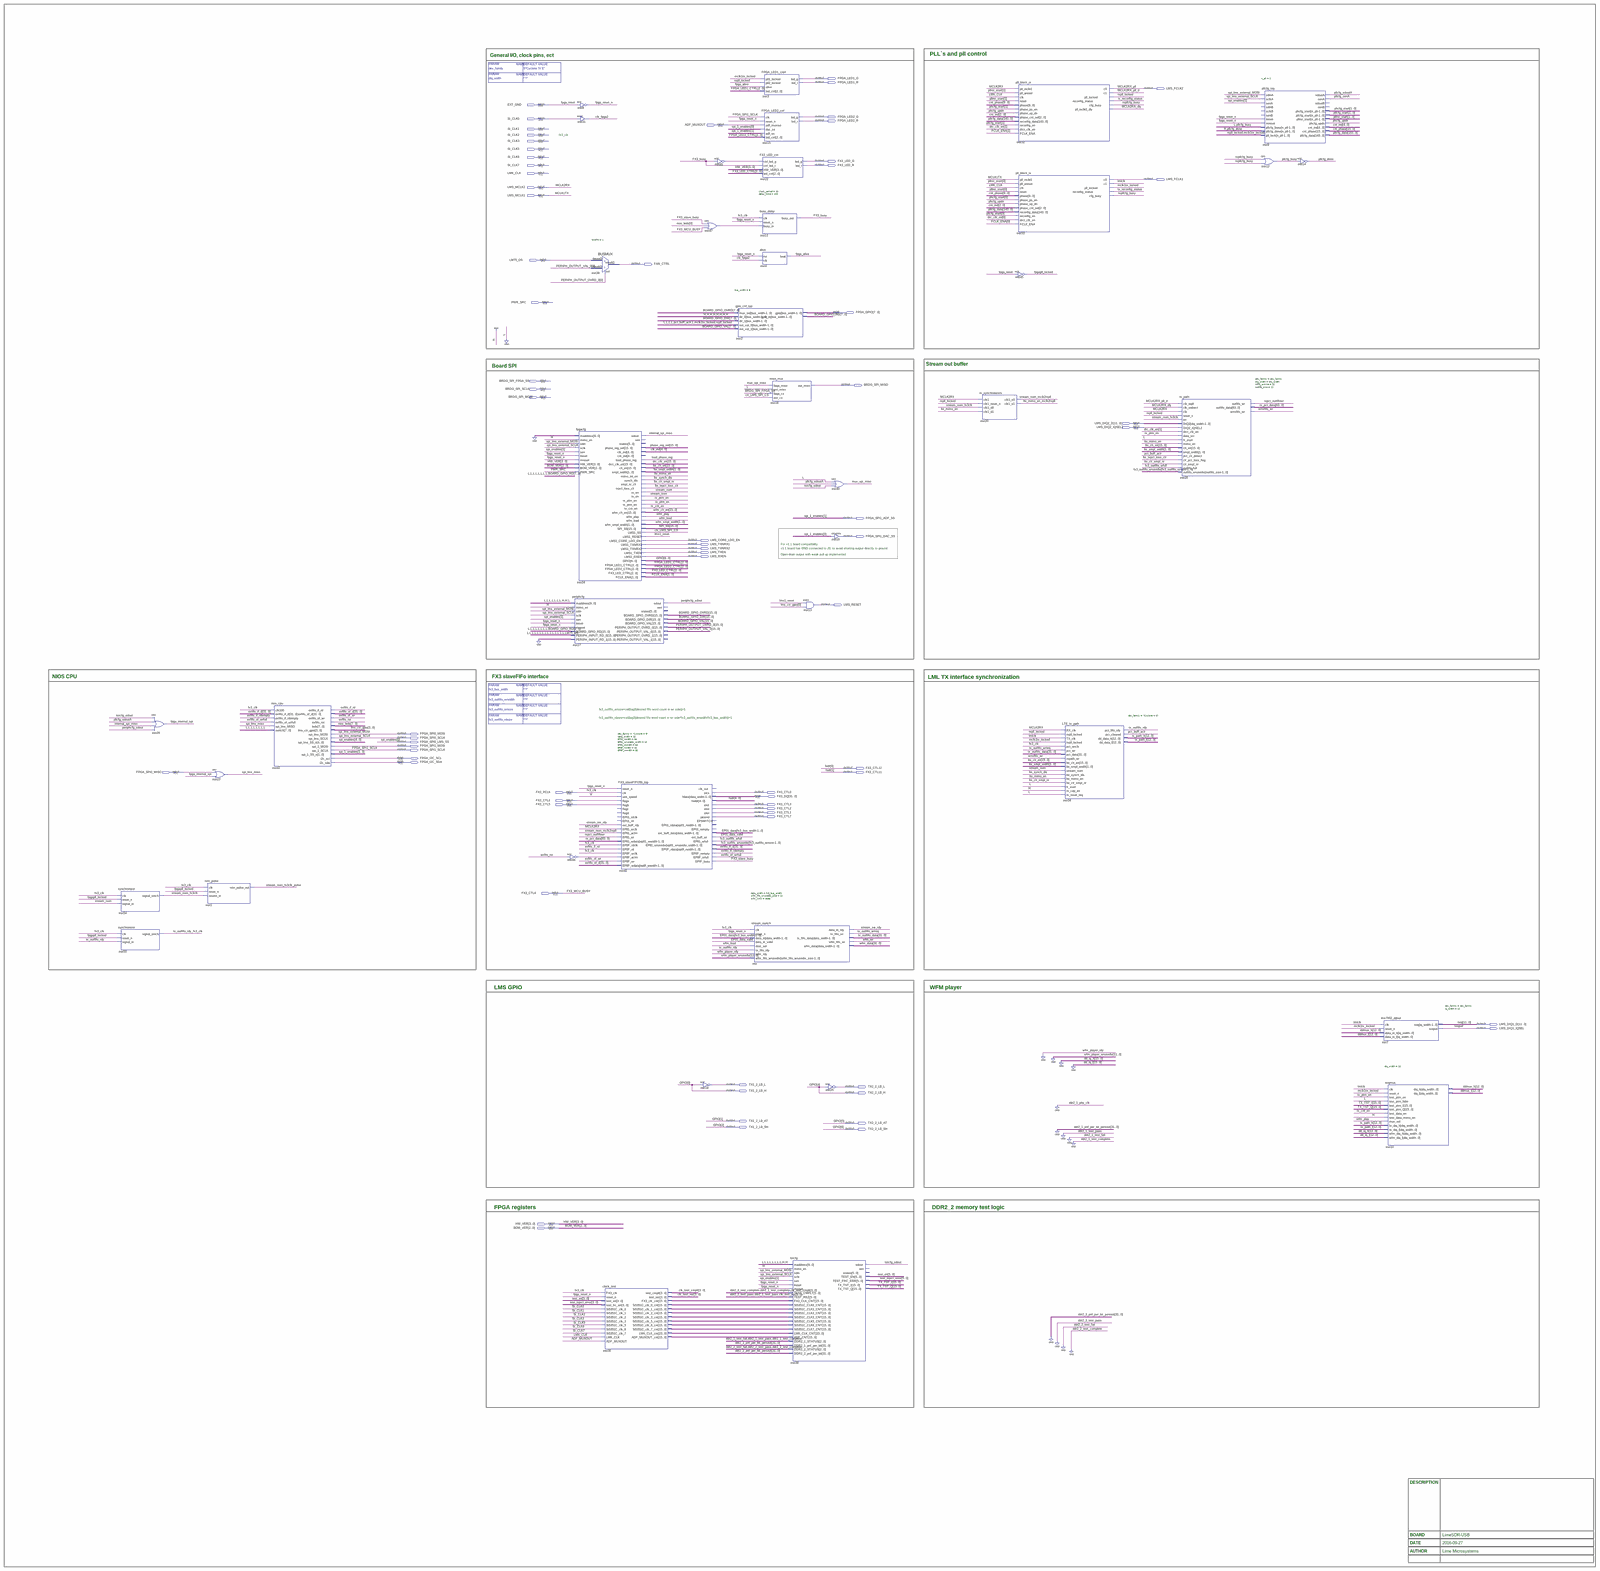
[diagram p0: schematic sheet, whole]
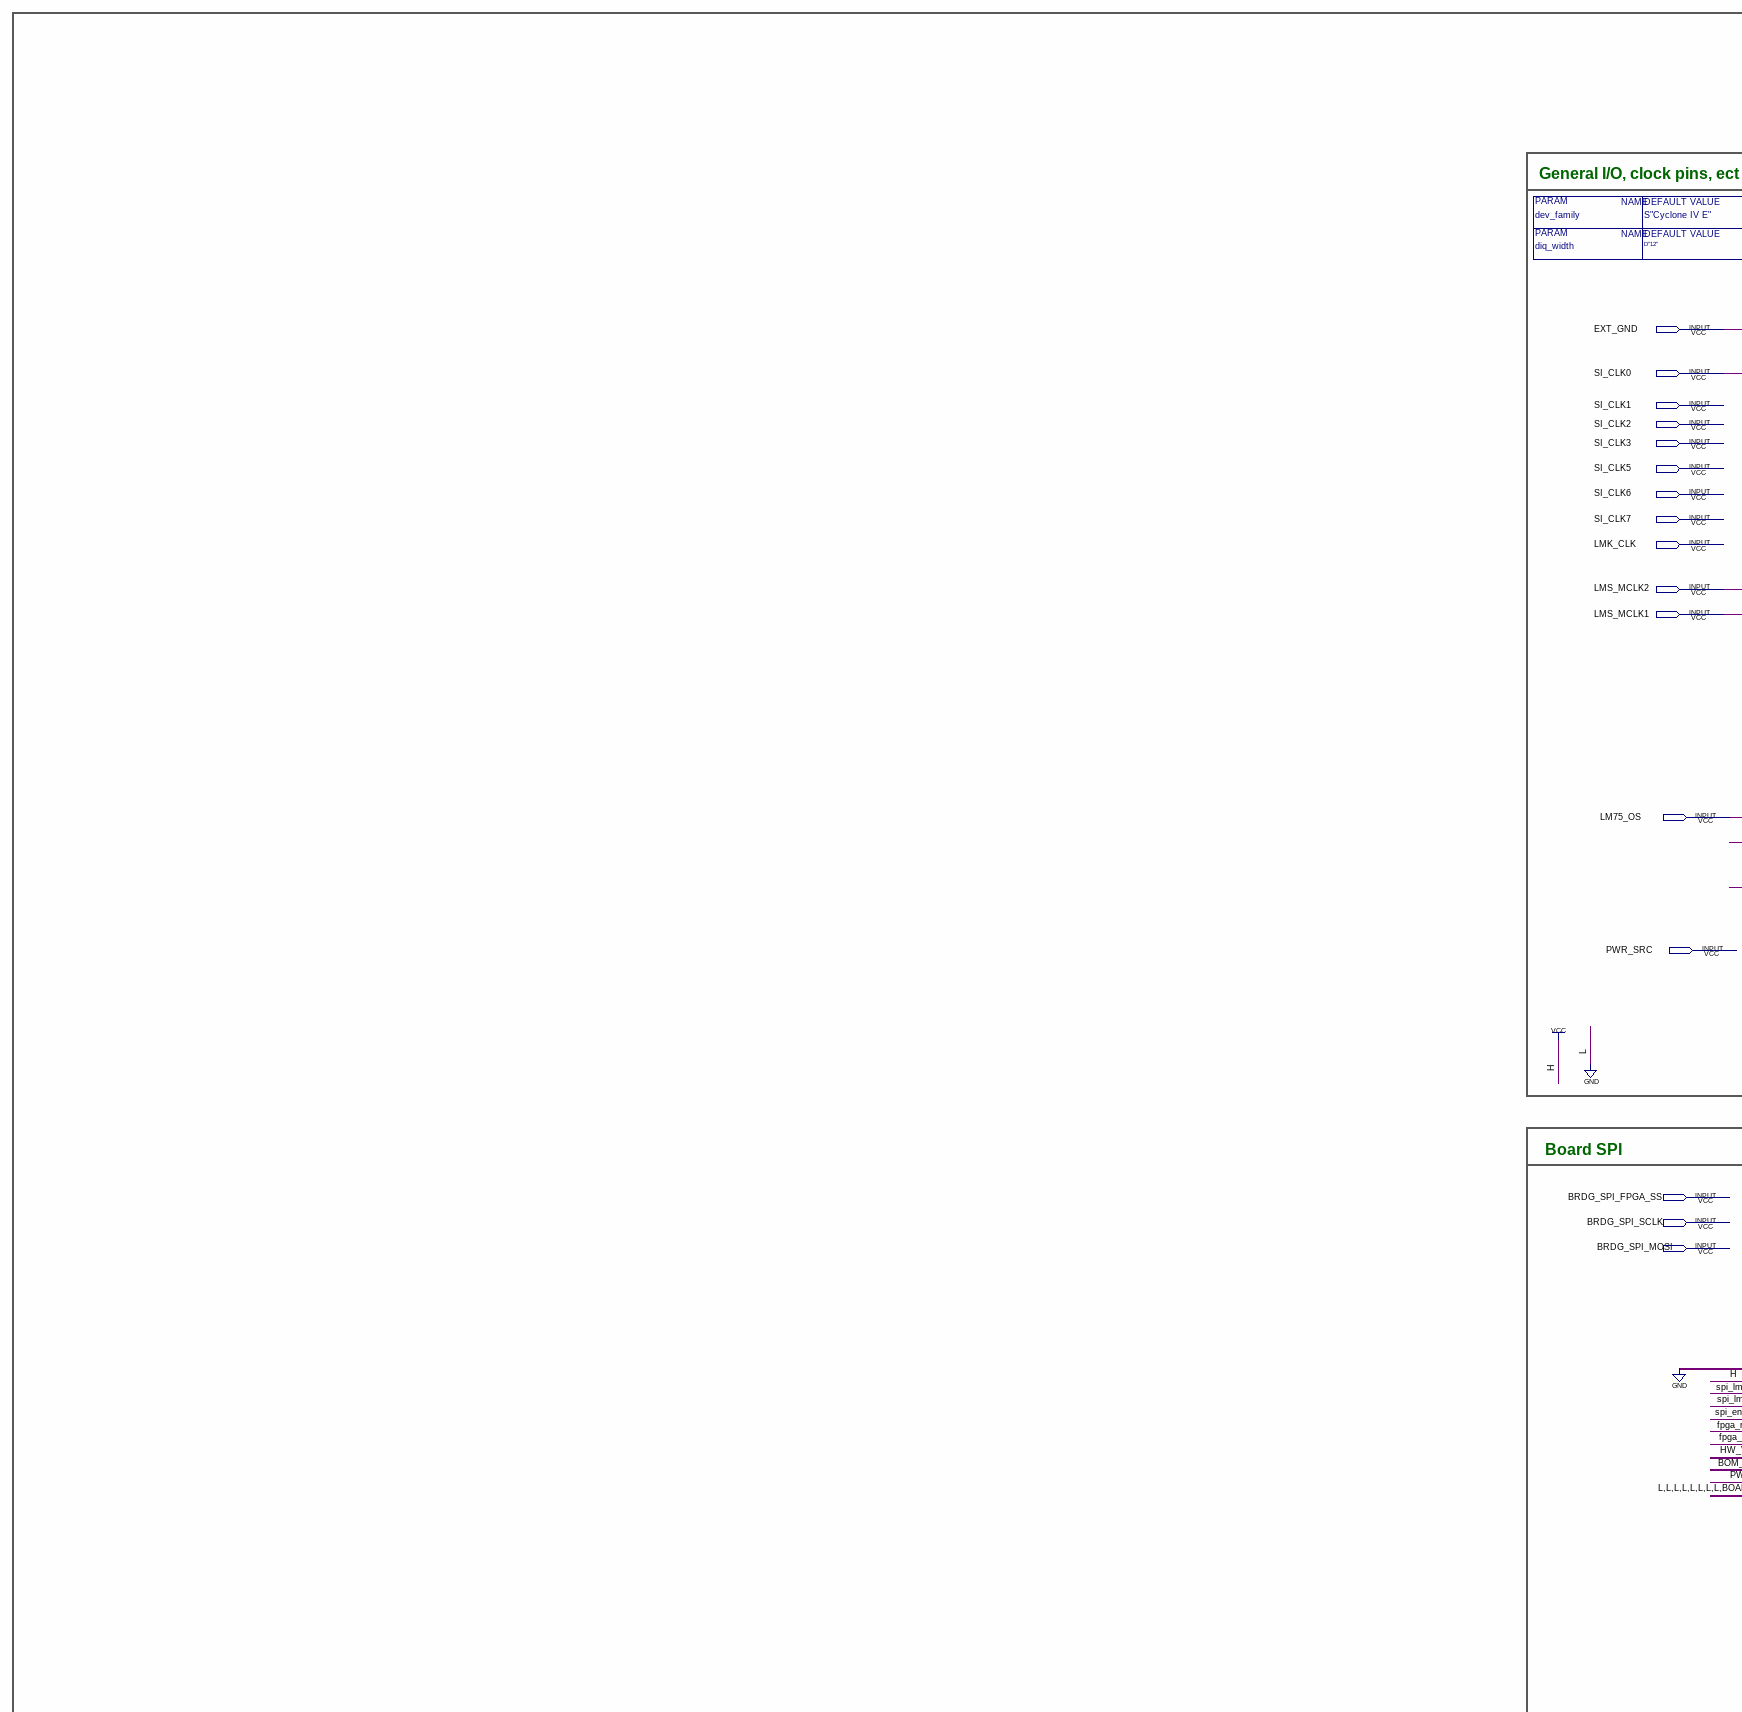
[diagram p1: schematic sheet, upper left part]
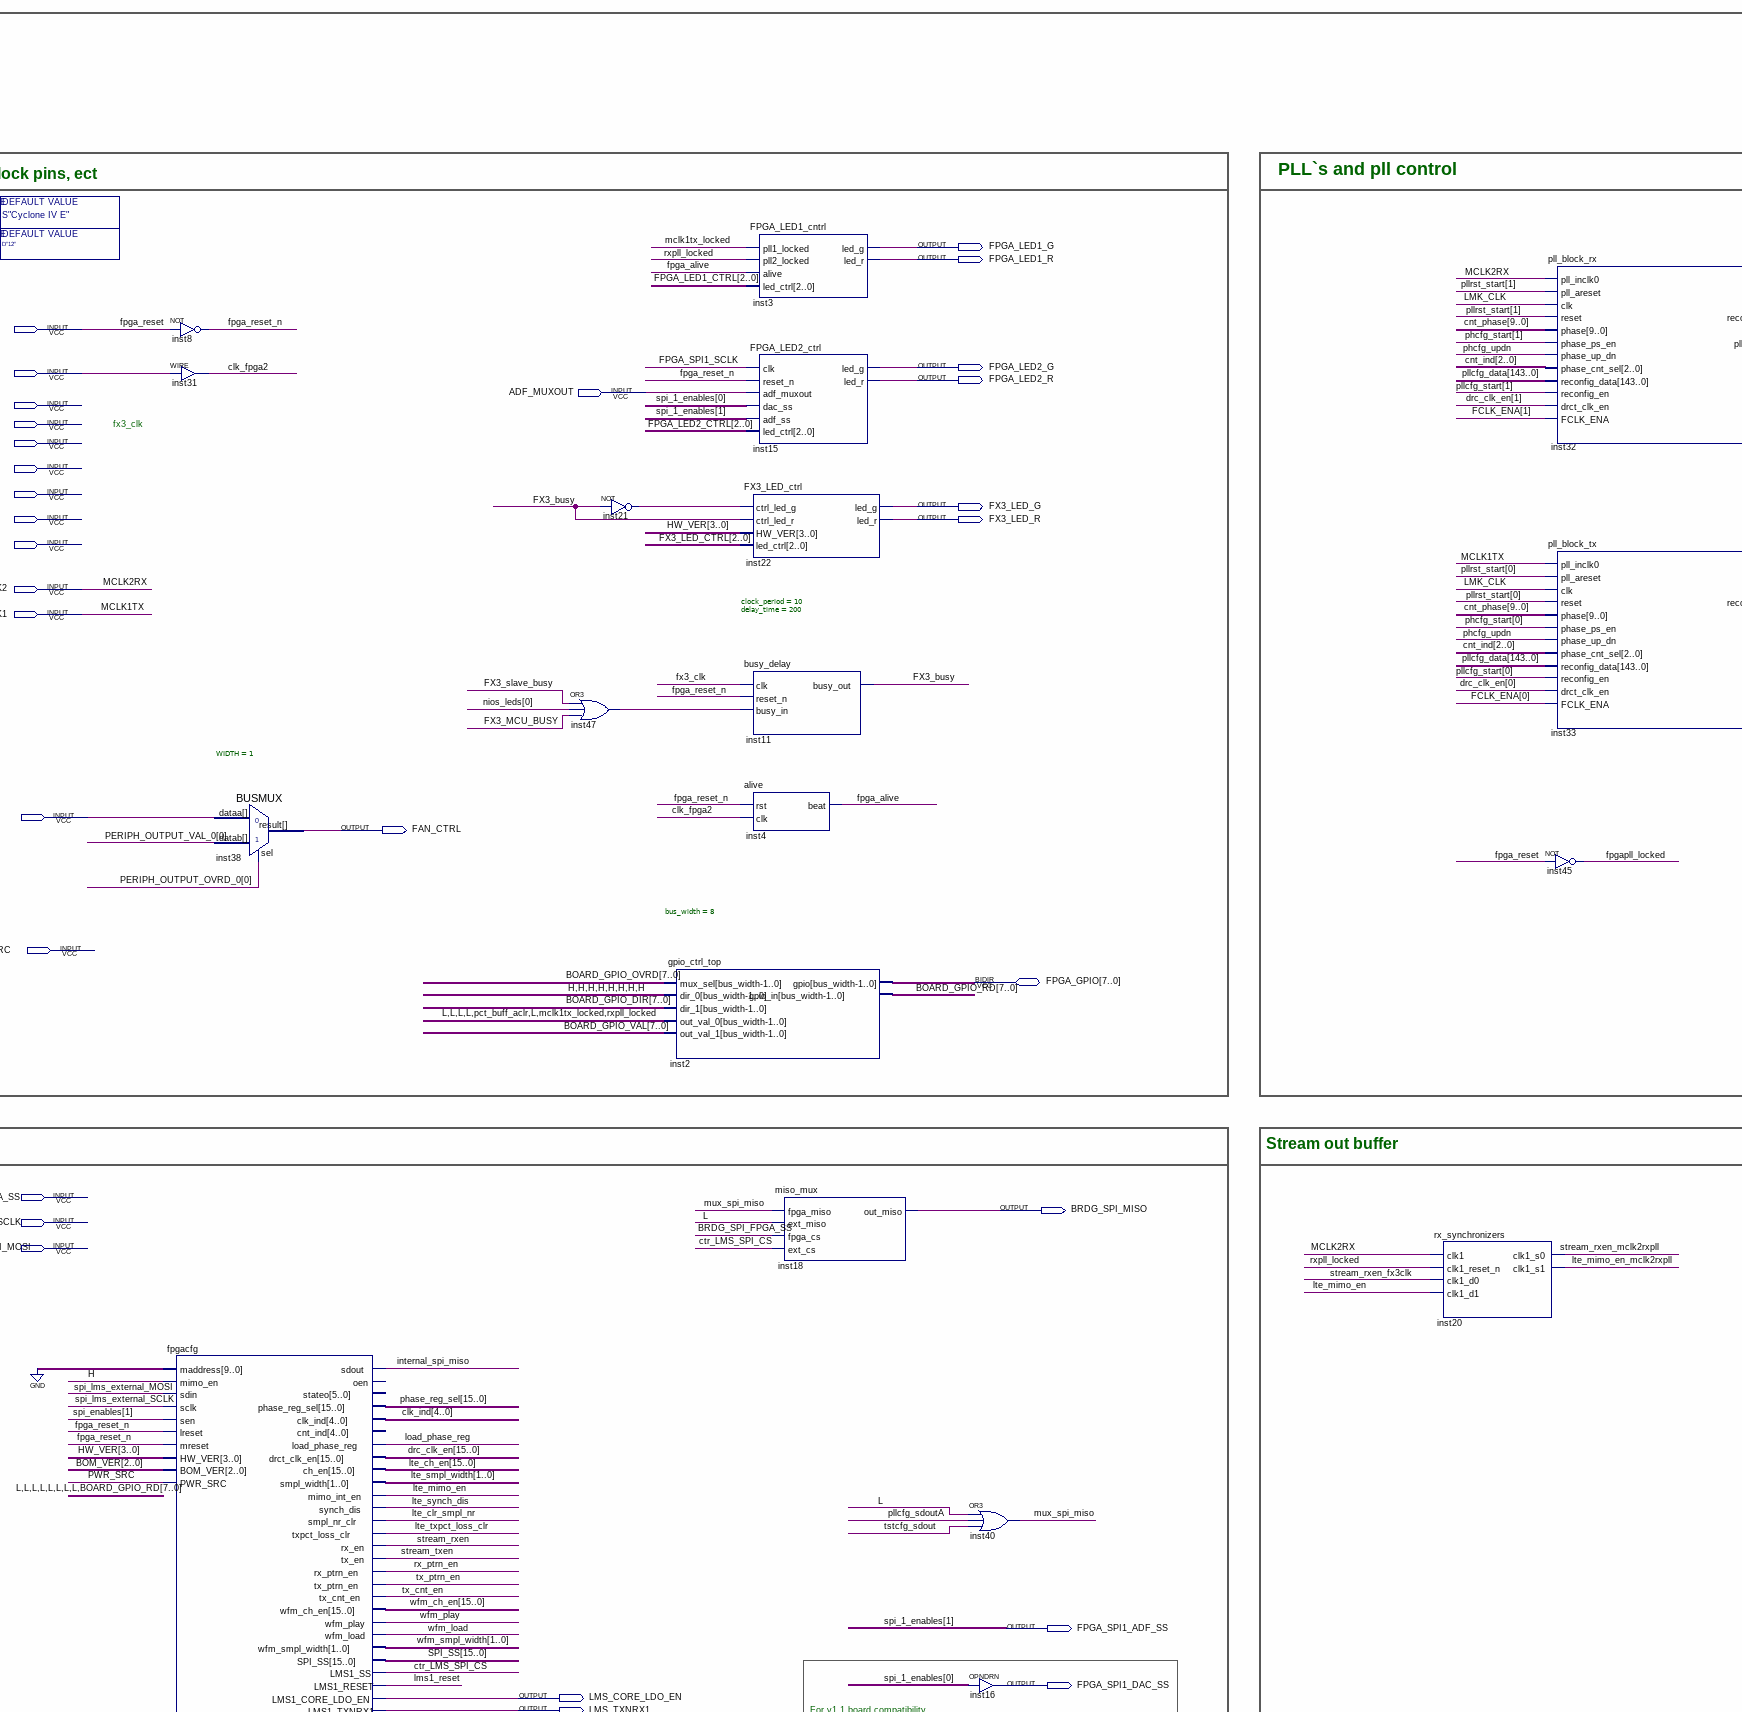
[diagram p2: schematic sheet, upper centre part]
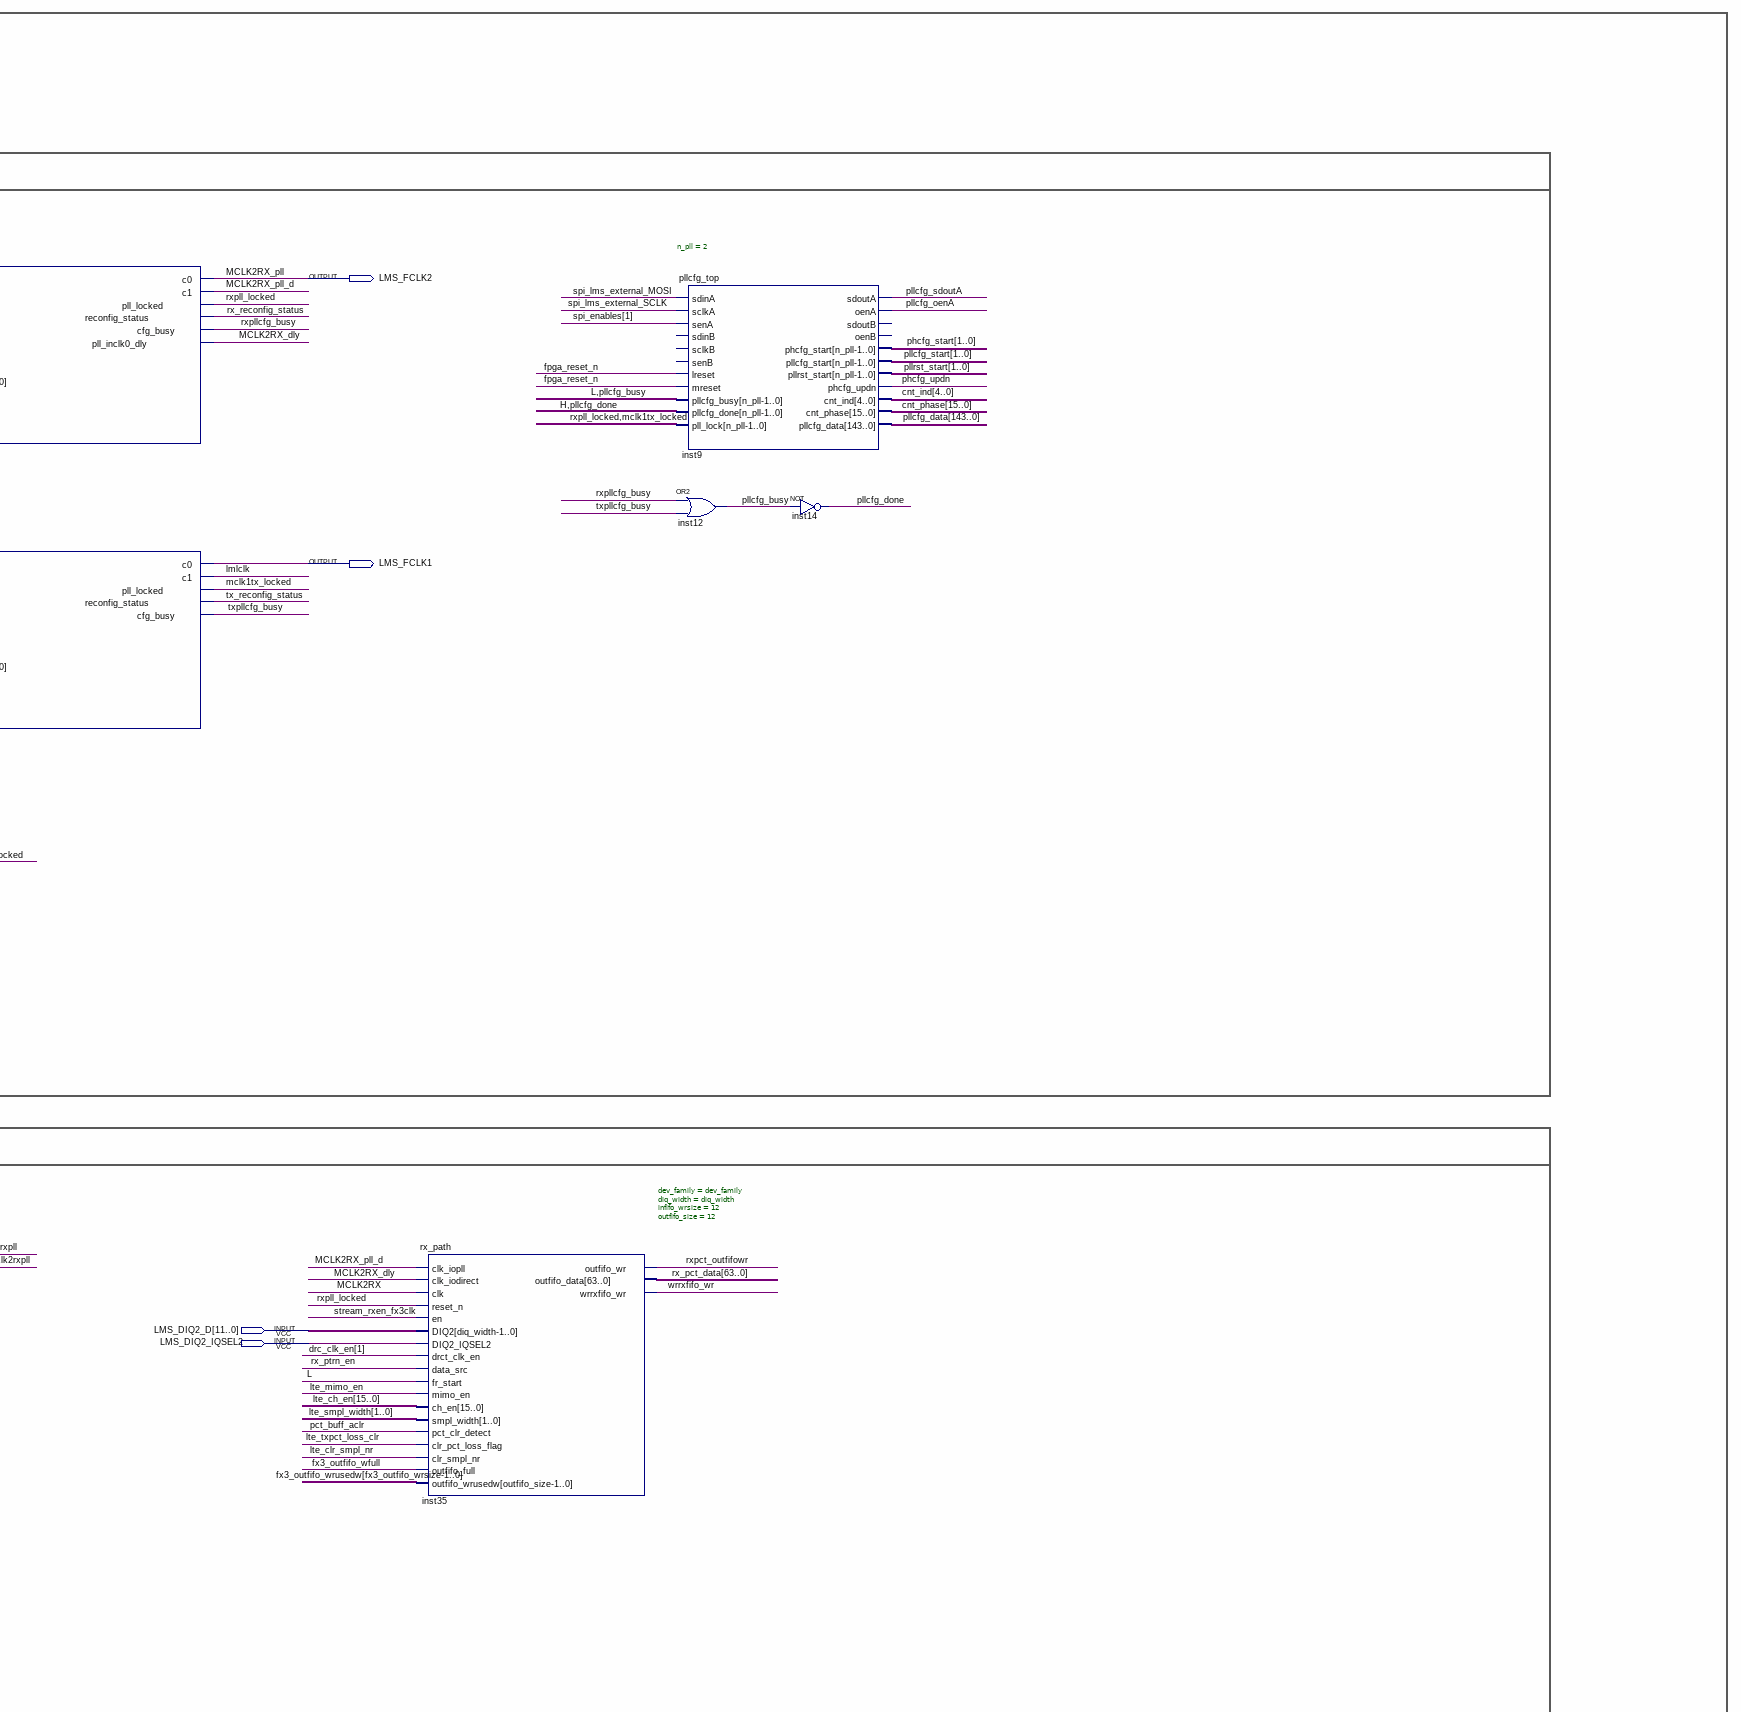
[diagram p3: schematic sheet, upper right part]
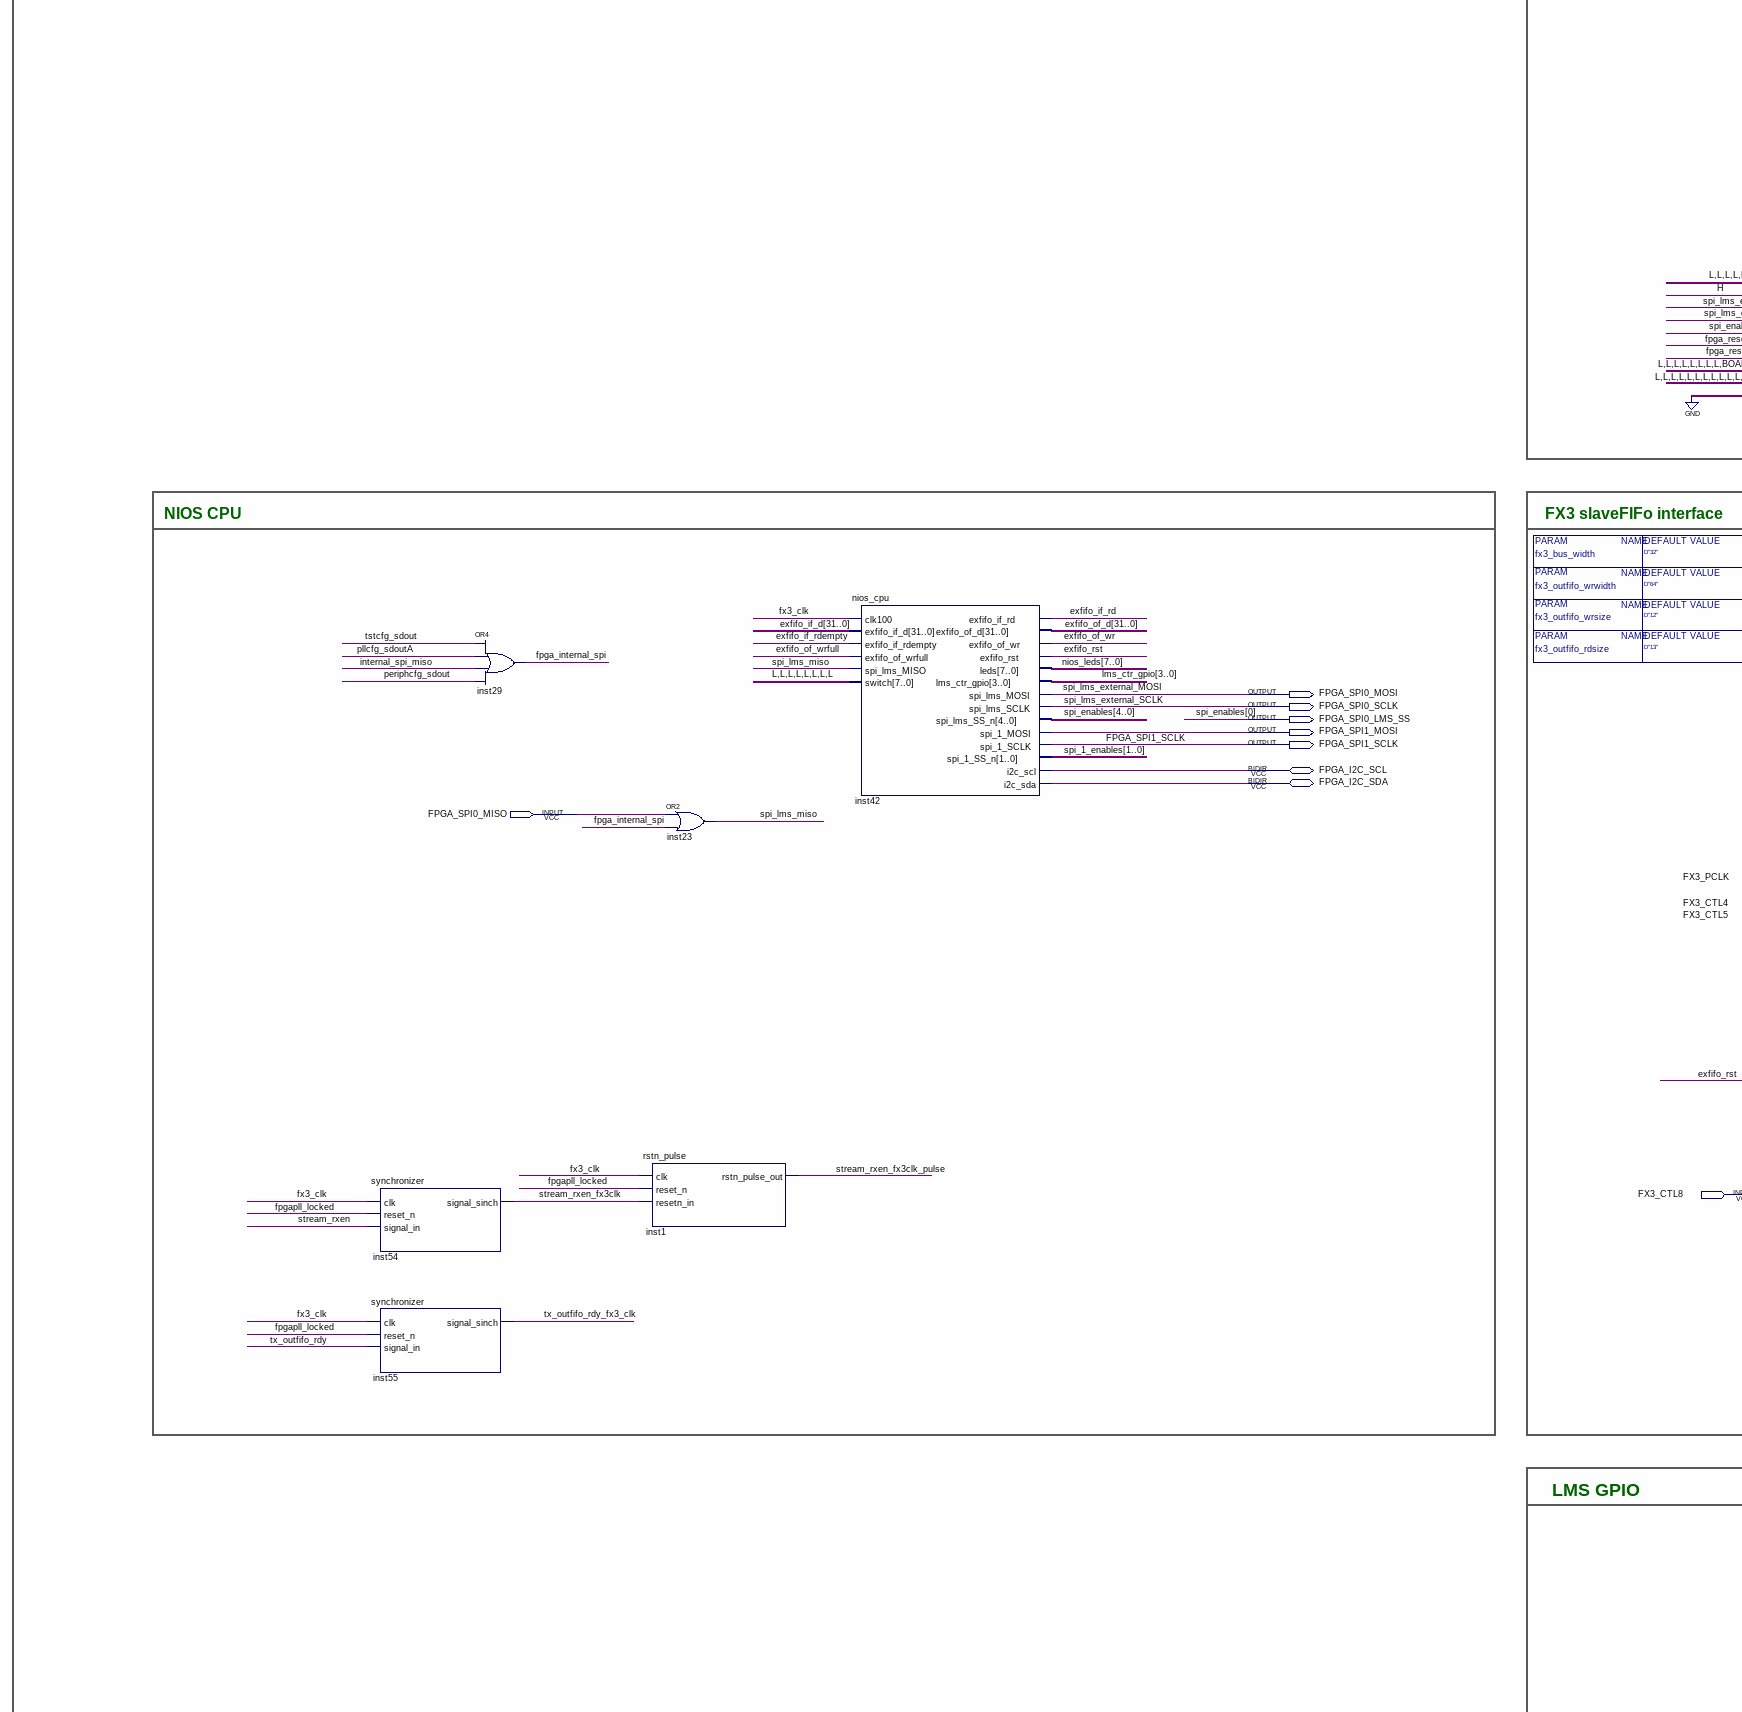
[diagram p4: schematic sheet, middle left part]
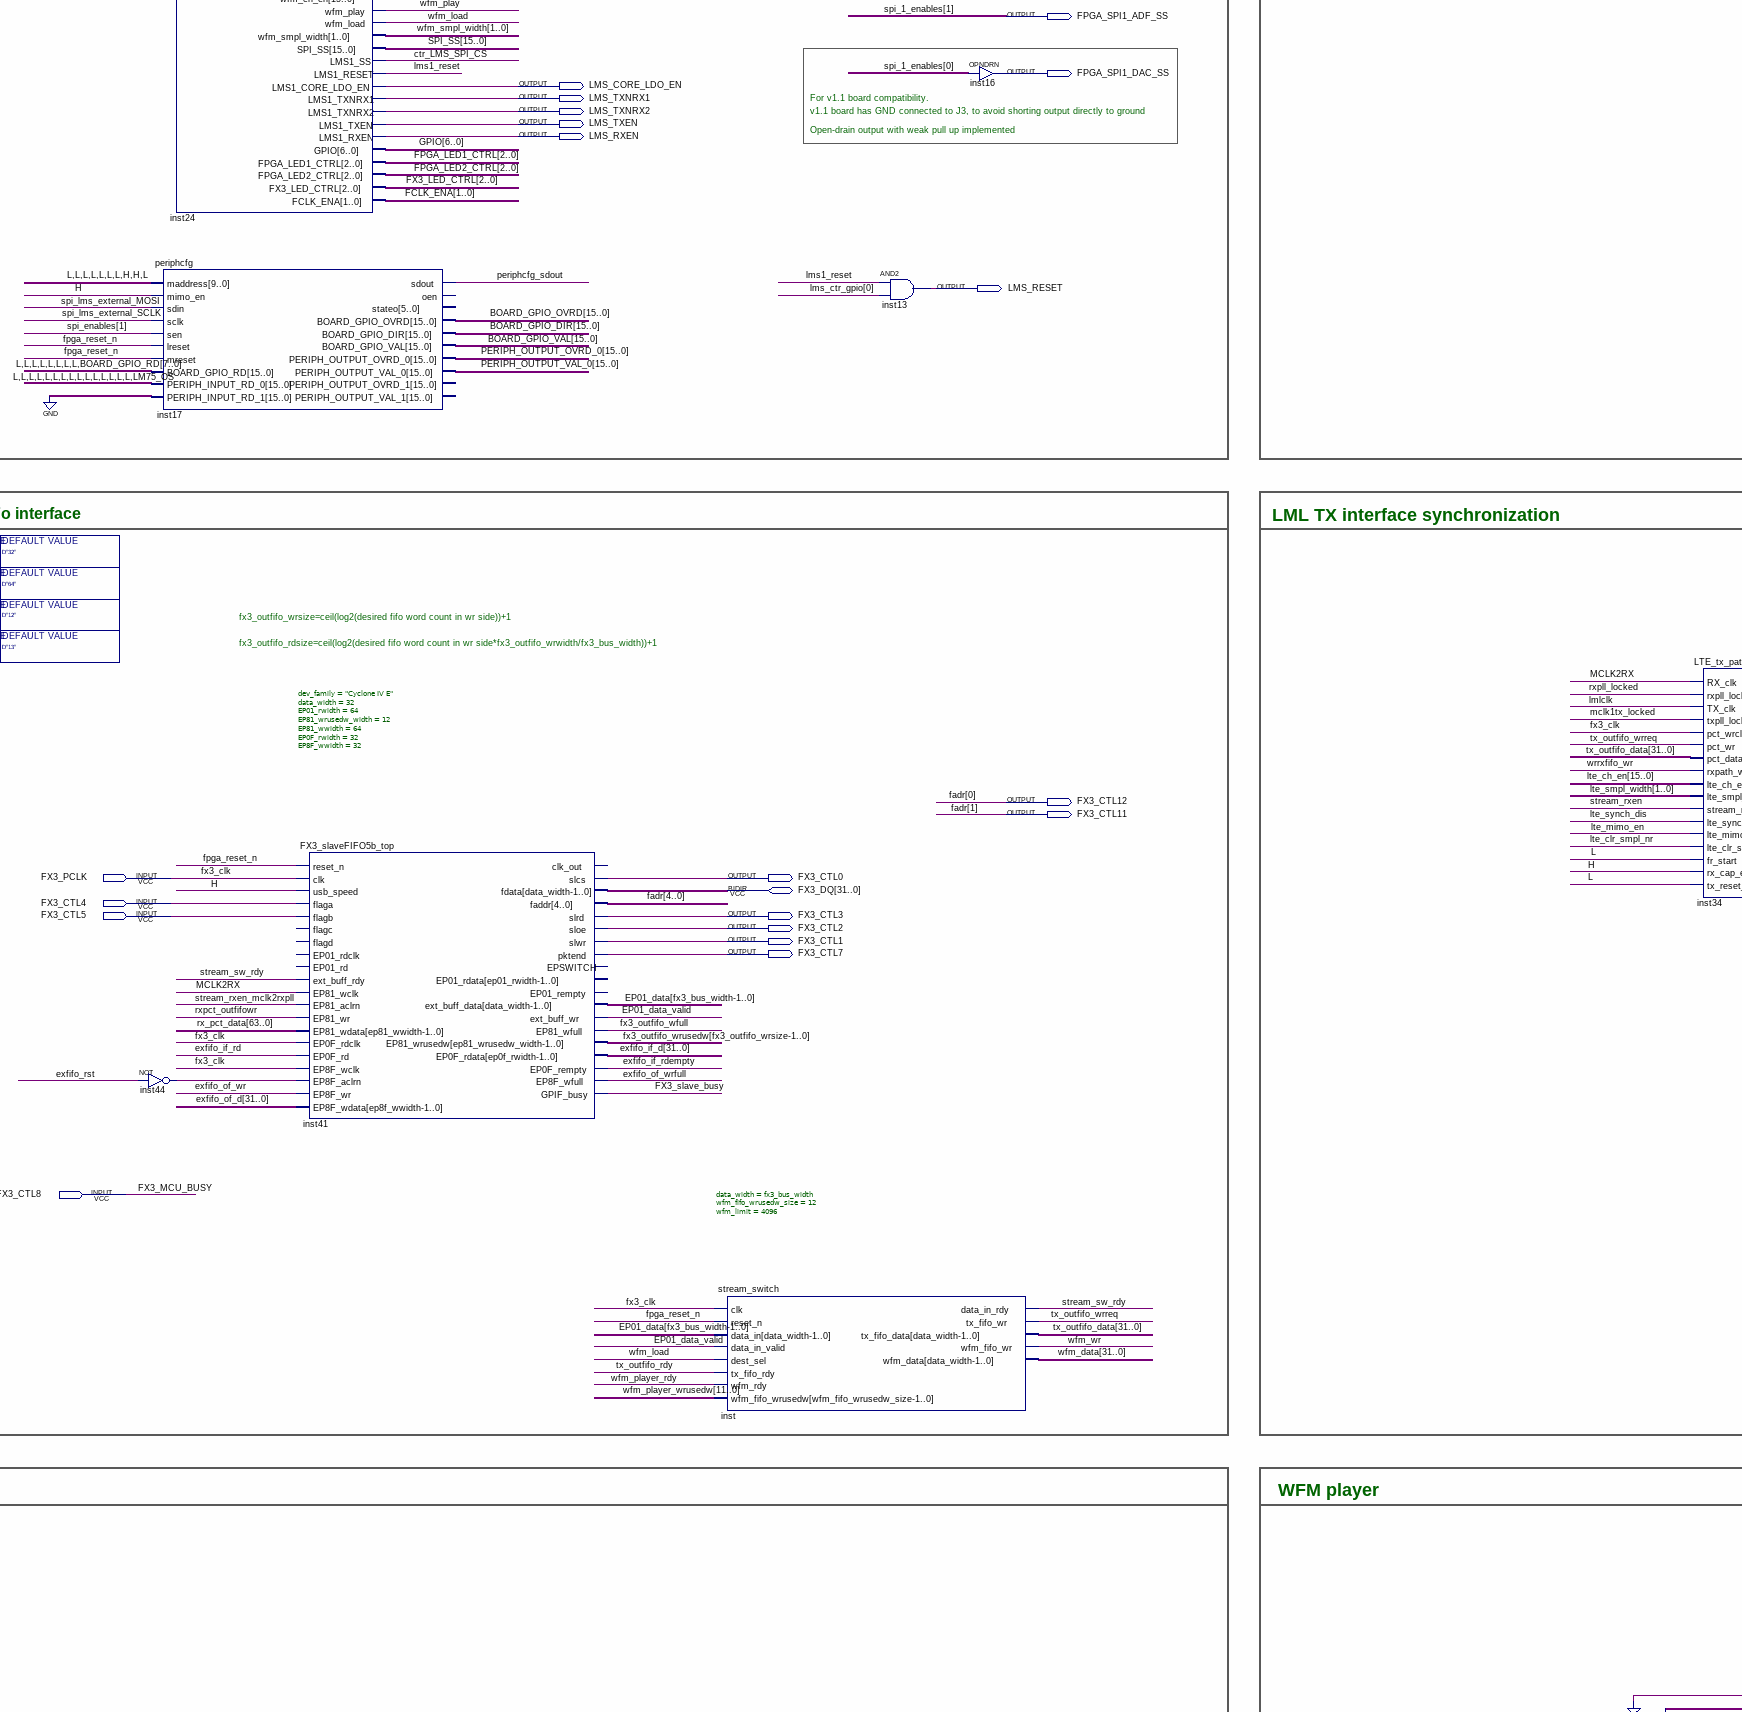
[diagram p5: schematic sheet, middle centre part]
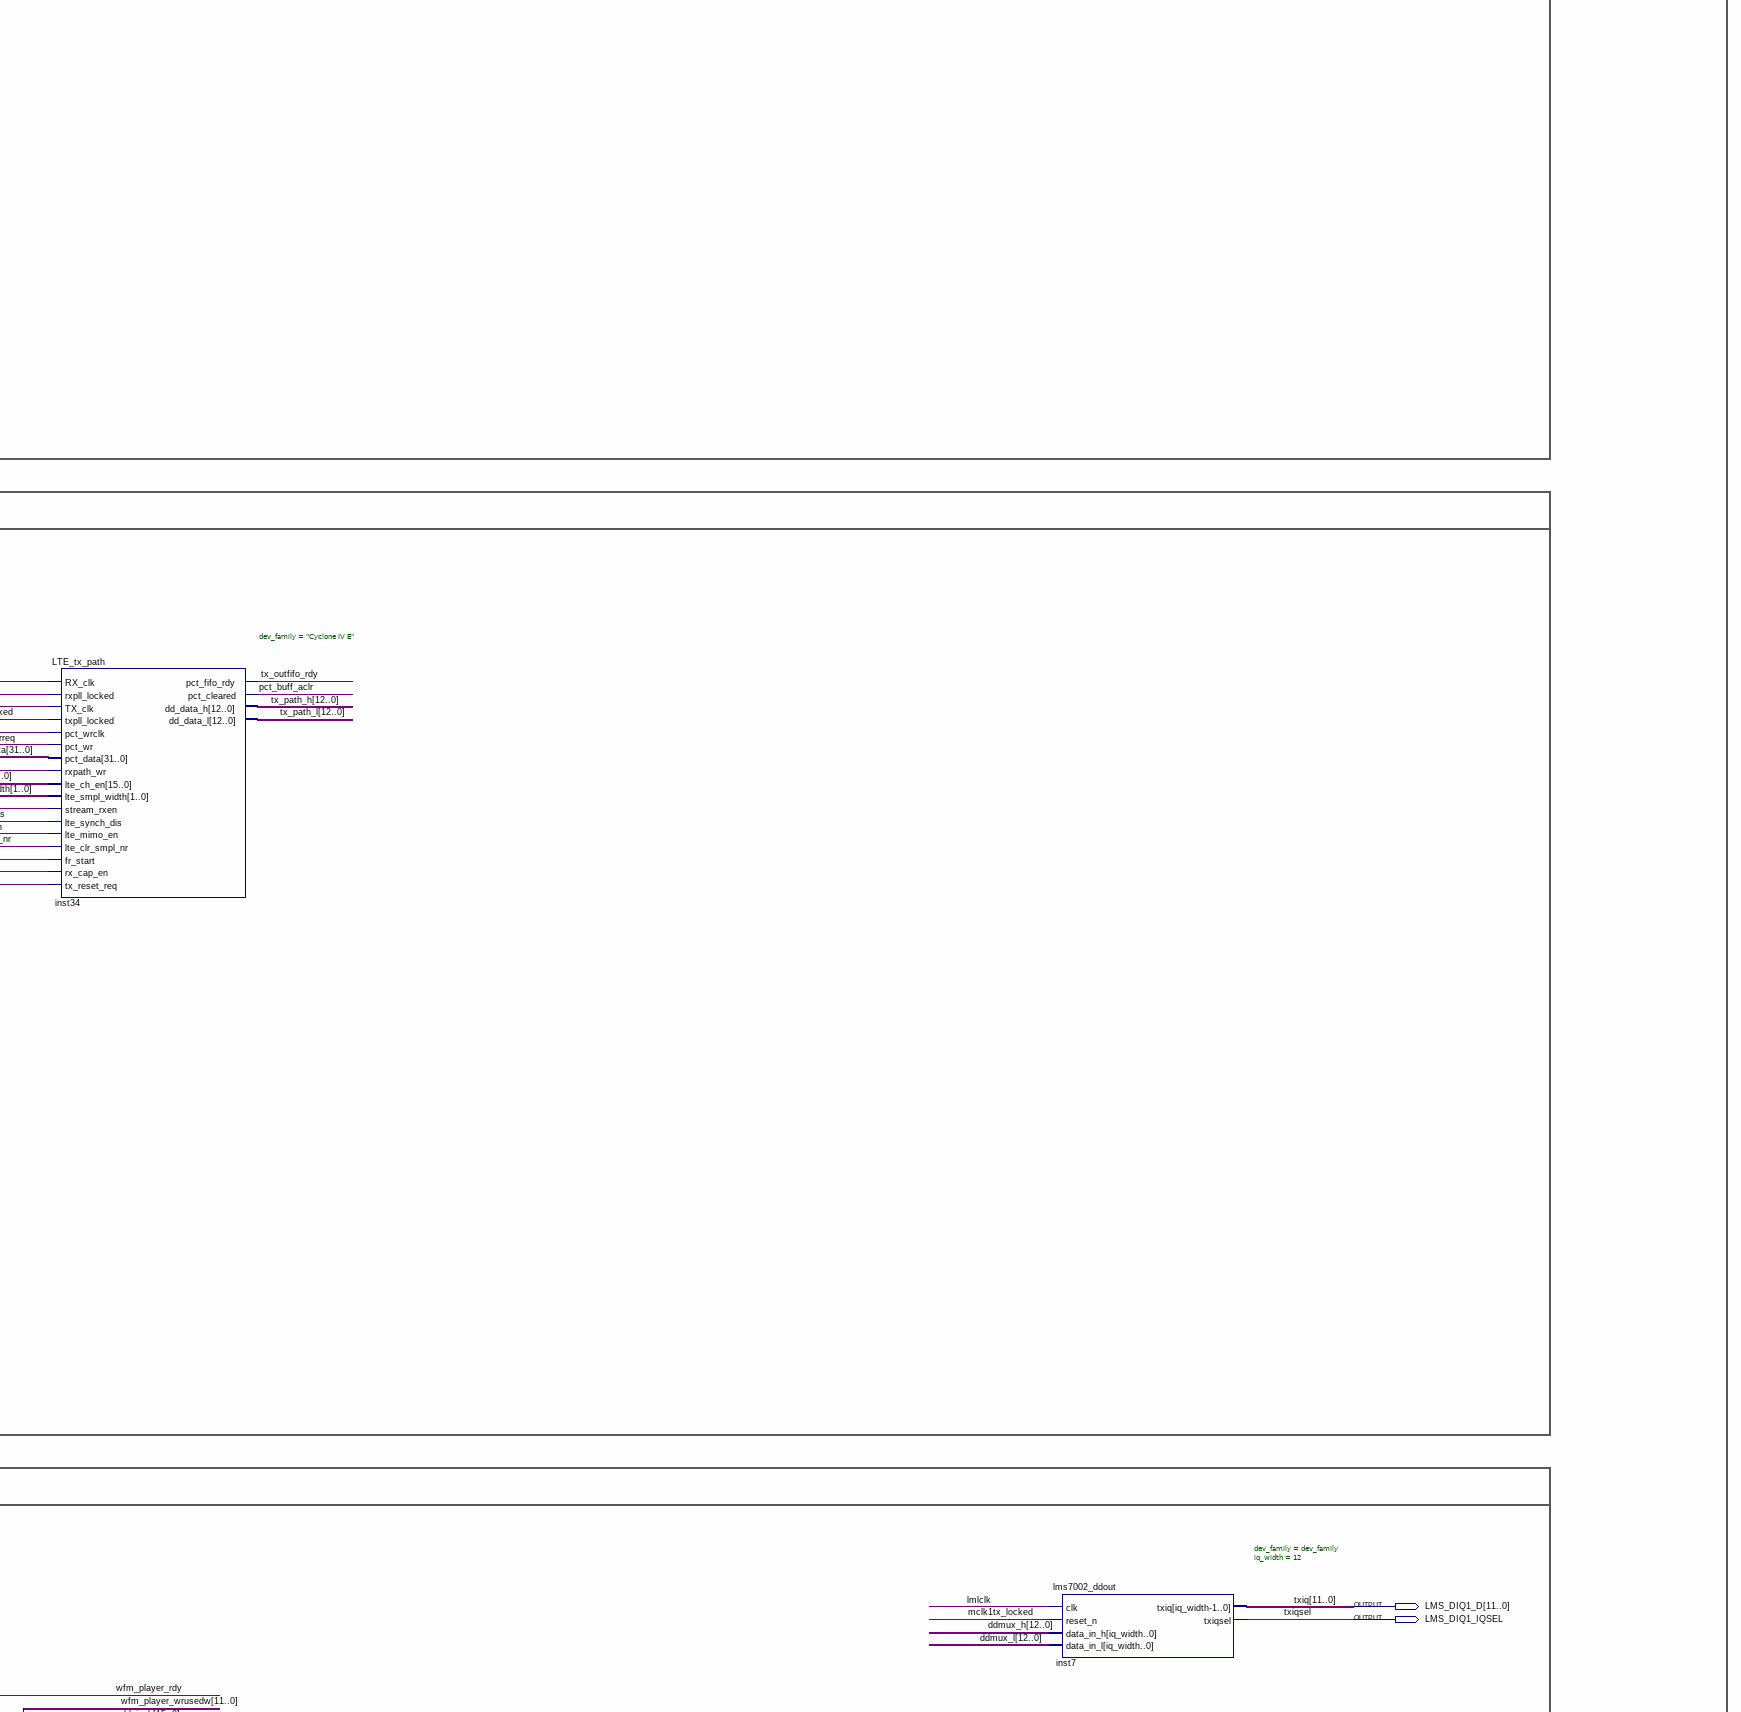
[diagram p6: schematic sheet, middle right part]
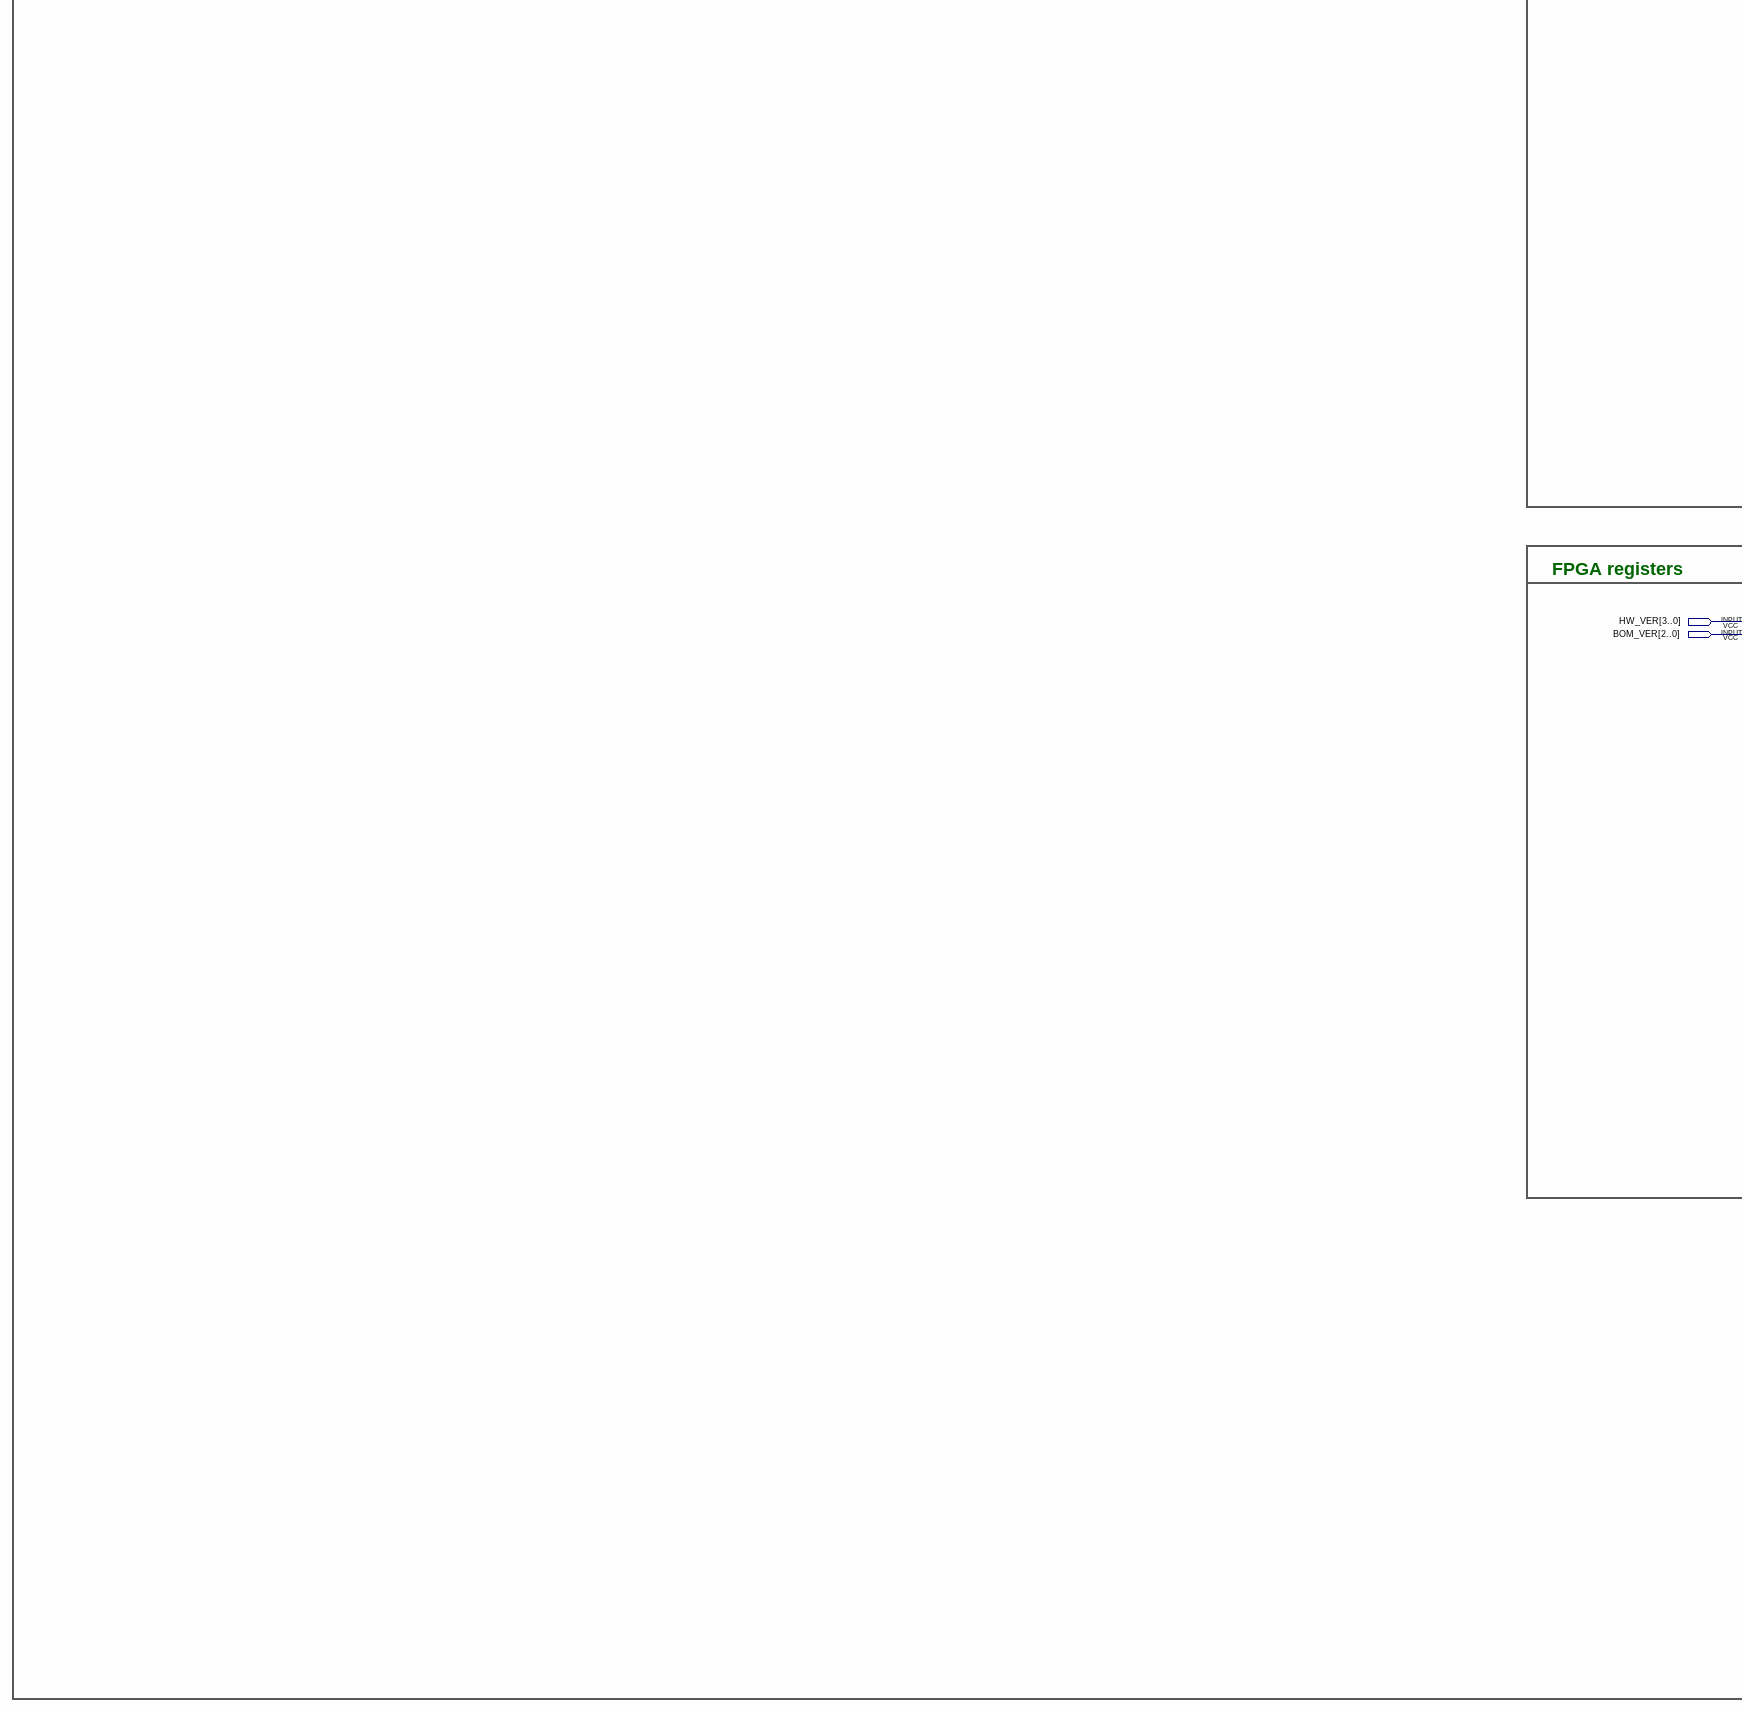
[diagram p7: schematic sheet, lower left part]
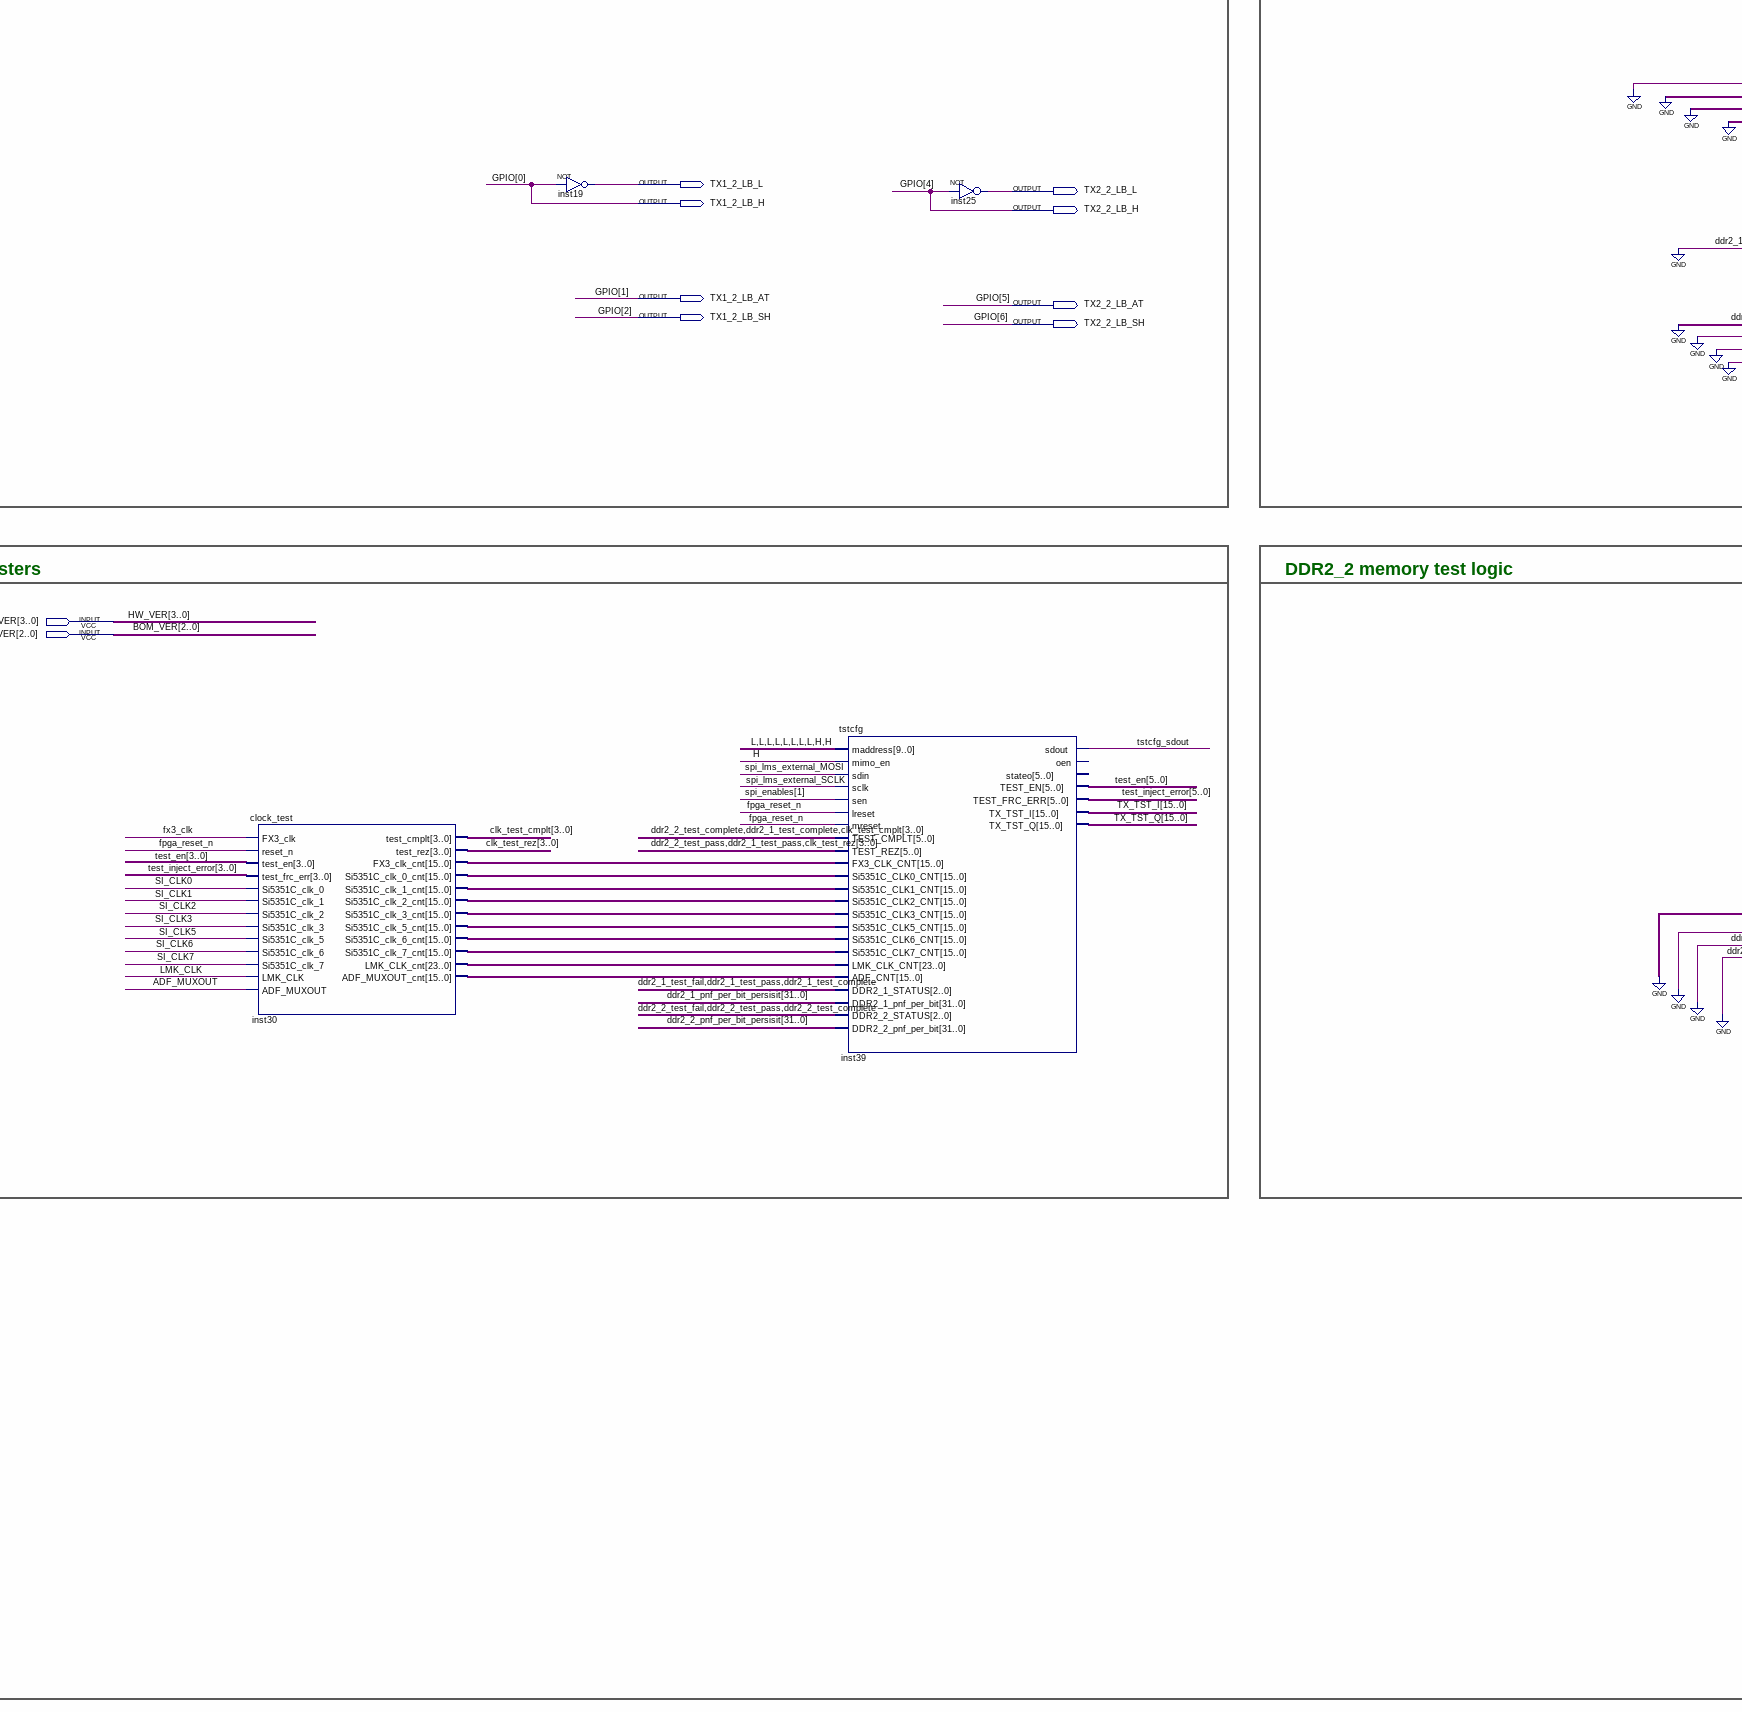
[diagram p8: schematic sheet, lower centre part]
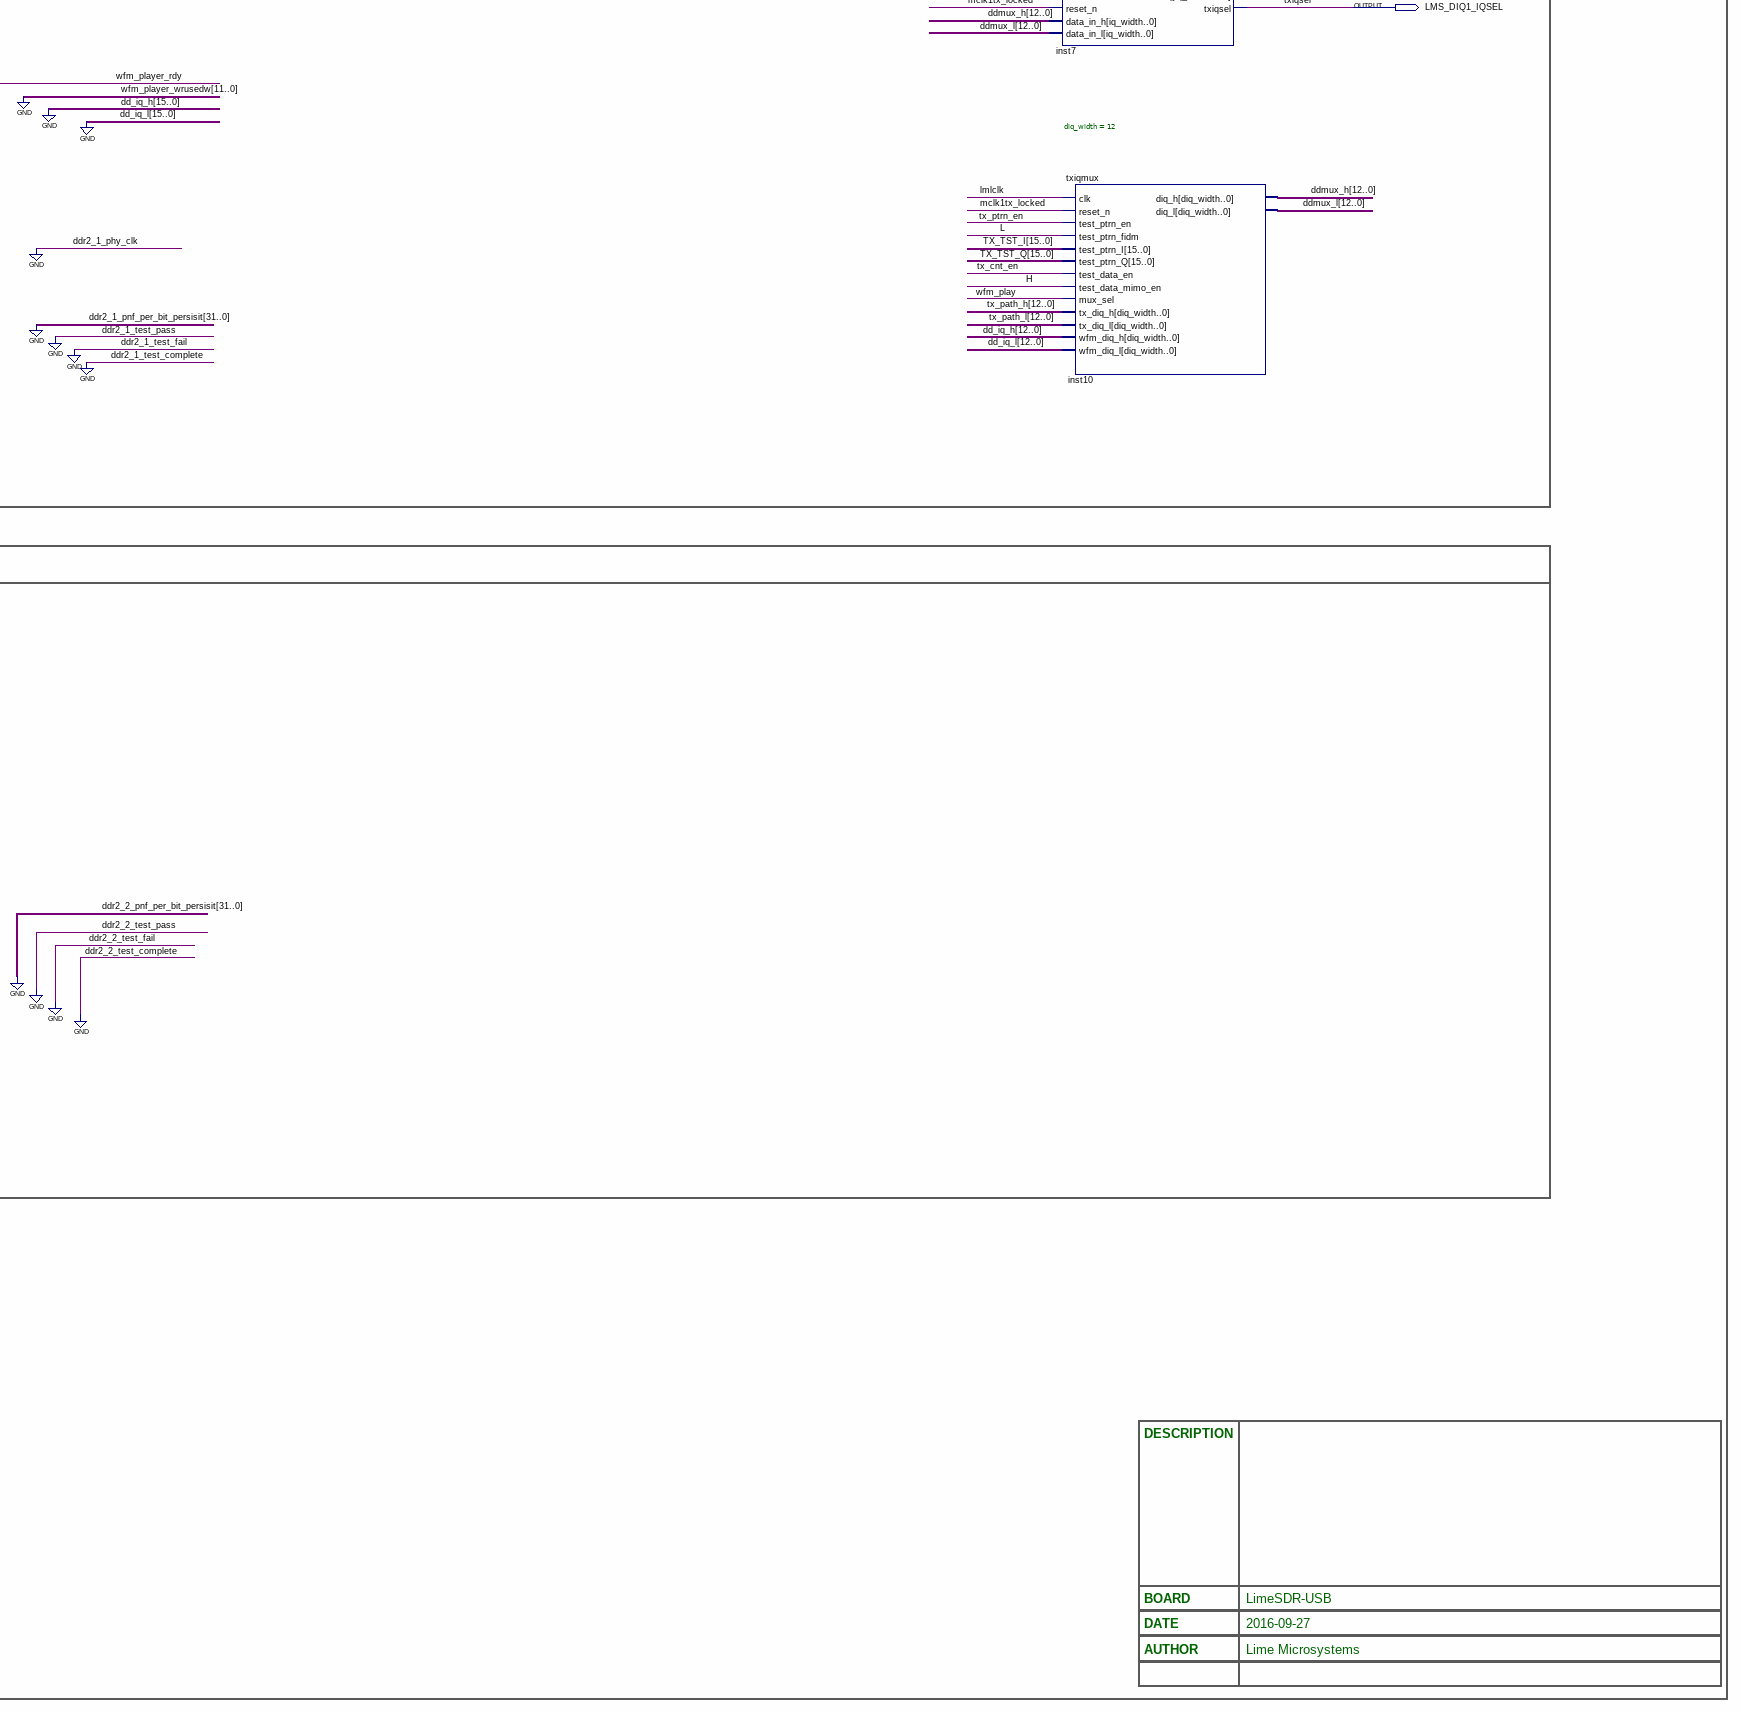
[diagram p9: schematic sheet, lower right part]
// Quartus schematic lms7_trx_top_no_ram.bdf as structural Verilog: 41 symbols, 70 pins
module lms7_trx_top_no_ram #(parameter dev_family = "S\"Cyclone IV E\"", parameter diq_width = "D\"12\"", parameter fx3_bus_width = "D\"32\"", parameter fx3_outfifo_wrwidth = "D\"64\"", parameter fx3_outfifo_wrsize = "D\"12\"", parameter fx3_outfifo_rdsize = "D\"13\"") (
  input  EXT_GND,
  input  SI_CLK0,
  input  ADF_MUXOUT,
  input  SI_CLK1,
  input  SI_CLK2,
  input  SI_CLK3,
  input  SI_CLK5,
  input  SI_CLK6,
  input  SI_CLK7,
  input  LMK_CLK,
  input  LMS_MCLK2,
  input  LMS_MCLK1,
  input  LM75_OS,
  input  PWR_SRC,
  input  BRDG_SPI_FPGA_SS,
  input  BRDG_SPI_SCLK,
  input  BRDG_SPI_MOSI,
  input  [11:0] LMS_DIQ2_D,
  input  LMS_DIQ2_IQSEL2,
  input  FPGA_SPI0_MISO,
  input  FX3_PCLK,
  input  FX3_CTL4,
  input  FX3_CTL5,
  input  FX3_CTL8,
  input  [3:0] HW_VER,
  input  [2:0] BOM_VER,
  inout  [7:0] FPGA_GPIO,
  inout  FPGA_I2C_SCL,
  inout  FPGA_I2C_SDA,
  inout  [31:0] FX3_DQ,
  output FPGA_LED1_G,
  output FPGA_LED1_R,
  output LMS_FCLK2,
  output FPGA_LED2_G,
  output FPGA_LED2_R,
  output FX3_LED_G,
  output FX3_LED_R,
  output LMS_FCLK1,
  output FAN_CTRL,
  output BRDG_SPI_MISO,
  output FPGA_SPI1_ADF_SS,
  output FPGA_SPI1_DAC_SS,
  output LMS_CORE_LDO_EN,
  output LMS_TXNRX1,
  output LMS_TXNRX2,
  output LMS_TXEN,
  output LMS_RXEN,
  output LMS_RESET,
  output FPGA_SPI0_MOSI,
  output FPGA_SPI0_SCLK,
  output FPGA_SPI0_LMS_SS,
  output FPGA_SPI1_MOSI,
  output FPGA_SPI1_SCLK,
  output FX3_CTL12,
  output FX3_CTL11,
  output FX3_CTL0,
  output FX3_CTL3,
  output FX3_CTL2,
  output FX3_CTL1,
  output FX3_CTL7,
  output [11:0] LMS_DIQ1_D,
  output LMS_DIQ1_IQSEL,
  output TX1_2_LB_L,
  output TX2_2_LB_L,
  output TX1_2_LB_H,
  output TX2_2_LB_H,
  output TX1_2_LB_AT,
  output TX2_2_LB_AT,
  output TX1_2_LB_SH,
  output TX2_2_LB_SH
);

  wire clk_fpga2, ctr_LMS_SPI_CS, \EP01_data[fx3_bus_width-1..0] , EP01_data_valid, exfifo_if_rd,
       exfifo_if_rdempty, exfifo_of_wr, exfifo_of_wrfull, exfifo_rst, fpga_alive, fpga_internal_spi,
       fpga_reset_n, fpgapll_locked, FX3_busy, fx3_outfifo_wfull,
       \fx3_outfifo_wrusedw[fx3_outfifo_wrsize-1..0] , FX3_slave_busy, inst21_out, inst44_out, inst47_out,
       internal_spi_miso, lmlclk, lms1_reset, load_phase_reg, lte_clr_smpl_nr, lte_mimo_en,
       lte_mimo_en_mclk2rxpll, lte_synch_dis, lte_txpct_loss_clr, mclk1tx_locked, MCLK2RX_dly, MCLK2RX_pll_d,
       mux_spi_miso, pct_buff_aclr, periphcfg_sdout, phcfg_updn, pllcfg_busy, pllcfg_done, pllcfg_oenA,
       pllcfg_sdoutA, rx_ptrn_en, rx_reconfig_status, rxpct_outfifowr, rxpll_locked, rxpllcfg_busy,
       spi_lms_miso, stream_rxen, stream_rxen_fx3clk, stream_rxen_fx3clk_pulse, stream_rxen_mclk2rxpll,
       stream_sw_rdy, stream_txen, tstcfg_sdout, tx_cnt_en, tx_outfifo_rdy, tx_outfifo_rdy_fx3_clk,
       tx_outfifo_wrreq, tx_ptrn_en, tx_reconfig_status, txpllcfg_busy, wfm_load, wfm_play, wfm_wr,
       wrrxfifo_wr;
  wire [0:0] spi_1_enables;
  wire [1:0] FCLK_ENA, lte_smpl_width, phcfg_start, pllcfg_start, pllrst_start, wfm_smpl_width;
  wire [2:0] FPGA_LED1_CTRL, FPGA_LED2_CTRL, FX3_LED_CTRL;
  wire [3:0] clk_test_cmplt, clk_test_rez, lms_ctr_gpio;
  wire [3:3] GPIO;
  wire [4:0] clk_ind, cnt_ind;
  wire [4:1] spi_enables;
  wire [4:2] fadr;
  wire [5:0] test_en, test_inject_error;
  wire [7:0] BOARD_GPIO_RD, nios_leds;
  wire [12:0] ddmux_h, ddmux_l, tx_path_h, tx_path_l;
  wire [15:0] BOARD_GPIO_DIR, BOARD_GPIO_OVRD, BOARD_GPIO_VAL, cnt_phase, drc_clk_en, inst30_adf_muxout_cnt,
       inst30_fx3_clk_cnt, inst30_si5351c_clk_0_cnt, inst30_si5351c_clk_1_cnt, inst30_si5351c_clk_2_cnt,
       inst30_si5351c_clk_3_cnt, inst30_si5351c_clk_5_cnt, inst30_si5351c_clk_6_cnt,
       inst30_si5351c_clk_7_cnt, lte_ch_en, PERIPH_OUTPUT_OVRD_0, PERIPH_OUTPUT_VAL_0, phase_reg_sel, SPI_SS,
       TX_TST_I, TX_TST_Q, wfm_ch_en;
  wire [23:0] inst30_lmk_clk_cnt;
  wire [31:0] exfifo_if_d, exfifo_of_d, tx_outfifo_data, wfm_data;
  wire [63:0] rx_pct_data;
  wire [143:0] pllcfg_data;

  synchronizer inst54 (
    .clk(FX3_PCLK), .reset_n(fpgapll_locked), .signal_in(stream_rxen), .signal_sinch(stream_rxen_fx3clk));
  synchronizer inst55 (
    .clk(FX3_PCLK), .reset_n(fpgapll_locked), .signal_in(tx_outfifo_rdy),
    .signal_sinch(tx_outfifo_rdy_fx3_clk));
  or inst29 (fpga_internal_spi, tstcfg_sdout, pllcfg_sdoutA, internal_spi_miso, periphcfg_sdout);
  rstn_pulse inst1 (
    .clk(FX3_PCLK), .reset_n(fpgapll_locked), .resetn_in(stream_rxen_fx3clk),
    .rstn_pulse_out(stream_rxen_fx3clk_pulse));
  or inst23 (spi_lms_miso, FPGA_SPI0_MISO, fpga_internal_spi);
  nios_cpu inst42 (
    .clk100(FX3_PCLK), .exfifo_if_d(exfifo_if_d), .exfifo_if_rdempty(exfifo_if_rdempty),
    .exfifo_of_wrfull(exfifo_of_wrfull), .spi_lms_MISO(spi_lms_miso), .switch({8{1'b0}}),
    .exfifo_if_rd(exfifo_if_rd), .exfifo_of_d(exfifo_of_d), .exfifo_of_wr(exfifo_of_wr),
    .exfifo_rst(exfifo_rst), .leds(nios_leds), .lms_ctr_gpio(lms_ctr_gpio), .spi_lms_MOSI(FPGA_SPI0_MOSI),
    .spi_lms_SCLK(FPGA_SPI0_SCLK), .spi_lms_SS_n({spi_enables, FPGA_SPI0_LMS_SS}),
    .spi_1_MOSI(FPGA_SPI1_MOSI), .spi_1_SCLK(FPGA_SPI1_SCLK),
    .spi_1_SS_n({FPGA_SPI1_ADF_SS, spi_1_enables[0]}), .i2c_scl(FPGA_I2C_SCL), .i2c_sda(FPGA_I2C_SDA));
  not inst8 (fpga_reset_n, EXT_GND);
  assign clk_fpga2 = SI_CLK0;  // WIRE inst31
  fpgacfg inst24 (
    .maddress({10{1'b0}}), .mimo_en(1'b1), .sdin(FPGA_SPI0_MOSI), .sclk(FPGA_SPI0_SCLK),
    .sen(spi_enables[1]), .lreset(fpga_reset_n), .mreset(fpga_reset_n), .HW_VER(HW_VER), .BOM_VER(BOM_VER),
    .PWR_SRC(PWR_SRC), .sdout(internal_spi_miso), .phase_reg_sel(phase_reg_sel), .clk_ind(clk_ind),
    .load_phase_reg(load_phase_reg), .drct_clk_en(drc_clk_en), .ch_en(lte_ch_en),
    .smpl_width(lte_smpl_width), .mimo_int_en(lte_mimo_en), .synch_dis(lte_synch_dis),
    .smpl_nr_clr(lte_clr_smpl_nr), .txpct_loss_clr(lte_txpct_loss_clr), .rx_en(stream_rxen),
    .tx_en(stream_txen), .rx_ptrn_en(rx_ptrn_en), .tx_ptrn_en(tx_ptrn_en), .tx_cnt_en(tx_cnt_en),
    .wfm_ch_en(wfm_ch_en), .wfm_play(wfm_play), .wfm_load(wfm_load), .wfm_smpl_width(wfm_smpl_width),
    .SPI_SS(SPI_SS), .LMS1_SS(ctr_LMS_SPI_CS), .LMS1_RESET(lms1_reset), .LMS1_CORE_LDO_EN(LMS_CORE_LDO_EN),
    .LMS1_TXNRX1(LMS_TXNRX1), .LMS1_TXNRX2(LMS_TXNRX2), .LMS1_TXEN(LMS_TXEN), .LMS1_RXEN(LMS_RXEN),
    .GPIO({TX2_2_LB_SH, TX2_2_LB_AT, TX2_2_LB_H, GPIO[3], TX1_2_LB_SH, TX1_2_LB_AT, TX1_2_LB_H}),
    .FPGA_LED1_CTRL(FPGA_LED1_CTRL), .FPGA_LED2_CTRL(FPGA_LED2_CTRL), .FX3_LED_CTRL(FX3_LED_CTRL),
    .FCLK_ENA(FCLK_ENA));  // open: oen, stateo, cnt_ind
  periphcfg inst17 (
    .maddress(10'b0000000110), .mimo_en(1'b1), .sdin(FPGA_SPI0_MOSI), .sclk(FPGA_SPI0_SCLK),
    .sen(spi_enables[1]), .lreset(fpga_reset_n), .mreset(fpga_reset_n),
    .BOARD_GPIO_RD({{8{1'b0}}, BOARD_GPIO_RD}), .PERIPH_INPUT_RD_0({{15{1'b0}}, LM75_OS}),
    .PERIPH_INPUT_RD_1({16{1'b0}}), .sdout(periphcfg_sdout), .BOARD_GPIO_OVRD(BOARD_GPIO_OVRD),
    .BOARD_GPIO_DIR(BOARD_GPIO_DIR), .BOARD_GPIO_VAL(BOARD_GPIO_VAL),
    .PERIPH_OUTPUT_OVRD_0(PERIPH_OUTPUT_OVRD_0), .PERIPH_OUTPUT_VAL_0(PERIPH_OUTPUT_VAL_0));  // open: oen, stateo, PERIPH_OUTPUT_OVRD_1, PERIPH_OUTPUT_VAL_1
  not inst44 (inst44_out, exfifo_rst);
  BUSMUX #(.WIDTH(1)) inst38 (
    .datab(PERIPH_OUTPUT_VAL_0[0]), .sel(PERIPH_OUTPUT_OVRD_0[0]), .dataa(LM75_OS), .result(FAN_CTRL));
  clock_test inst30 (
    .FX3_clk(FX3_PCLK), .reset_n(fpga_reset_n), .test_en(test_en[3:0]),
    .test_frc_err(test_inject_error[3:0]), .Si5351C_clk_0(SI_CLK0), .Si5351C_clk_1(SI_CLK1),
    .Si5351C_clk_2(SI_CLK2), .Si5351C_clk_3(SI_CLK3), .Si5351C_clk_5(SI_CLK5), .Si5351C_clk_6(SI_CLK6),
    .Si5351C_clk_7(SI_CLK7), .LMK_CLK(LMK_CLK), .ADF_MUXOUT(ADF_MUXOUT), .test_cmplt(clk_test_cmplt),
    .test_rez(clk_test_rez), .FX3_clk_cnt(inst30_fx3_clk_cnt), .Si5351C_clk_0_cnt(inst30_si5351c_clk_0_cnt),
    .Si5351C_clk_1_cnt(inst30_si5351c_clk_1_cnt), .Si5351C_clk_2_cnt(inst30_si5351c_clk_2_cnt),
    .Si5351C_clk_3_cnt(inst30_si5351c_clk_3_cnt), .Si5351C_clk_5_cnt(inst30_si5351c_clk_5_cnt),
    .Si5351C_clk_6_cnt(inst30_si5351c_clk_6_cnt), .Si5351C_clk_7_cnt(inst30_si5351c_clk_7_cnt),
    .LMK_CLK_cnt(inst30_lmk_clk_cnt), .ADF_MUXOUT_cnt(inst30_adf_muxout_cnt));
  FX3_slaveFIFO5b_top #(.dev_family("Cyclone IV E"), .data_width(32), .EP01_rwidth(64), .EP81_wrusedw_width(12), .EP81_wwidth(64), .EP0F_rwidth(32), .EP8F_wwidth(32)) inst41 (
    .reset_n(fpga_reset_n), .clk(FX3_PCLK), .usb_speed(1'b1), .flaga(FX3_CTL4), .flagb(FX3_CTL5),
    .ext_buff_rdy(stream_sw_rdy), .EP81_wclk(LMS_MCLK2), .EP81_aclrn(stream_rxen_mclk2rxpll),
    .EP81_wr(rxpct_outfifowr), .EP81_wdata(rx_pct_data), .EP0F_rdclk(FX3_PCLK), .EP0F_rd(exfifo_if_rd),
    .EP8F_wclk(FX3_PCLK), .EP8F_aclrn(inst44_out), .EP8F_wr(exfifo_of_wr), .EP8F_wdata(exfifo_of_d),
    .slcs(FX3_CTL0), .faddr({fadr, FX3_CTL11, FX3_CTL12}), .slrd(FX3_CTL3), .sloe(FX3_CTL2), .slwr(FX3_CTL1),
    .pktend(FX3_CTL7), .ext_buff_data(\EP01_data[fx3_bus_width-1..0] ), .ext_buff_wr(EP01_data_valid),
    .EP81_wfull(fx3_outfifo_wfull), .EP81_wrusedw(\fx3_outfifo_wrusedw[fx3_outfifo_wrsize-1..0] ),
    .EP0F_rdata(exfifo_if_d), .EP0F_rempty(exfifo_if_rdempty), .EP8F_wfull(exfifo_of_wrfull),
    .GPIF_busy(FX3_slave_busy), .fdata(FX3_DQ));  // open: flagc, flagd, EP01_rdclk, EP01_rd, clk_out, EPSWITCH, EP01_rdata, EP01_rempty
  or inst47 (inst47_out, FX3_slave_busy, nios_leds[0], FX3_CTL8);
  not inst19 (TX1_2_LB_L, TX1_2_LB_H);
  not inst21 (inst21_out, FX3_busy);
  gpio_ctrl_top #(.bus_width(8)) inst2 (
    .mux_sel(BOARD_GPIO_OVRD[7:0]), .dir_0({8{1'b1}}), .dir_1(BOARD_GPIO_DIR[7:0]),
    .out_val_0({4'b0000, pct_buff_aclr, 1'b0, mclk1tx_locked, rxpll_locked}),
    .out_val_1(BOARD_GPIO_VAL[7:0]), .gpio_in(BOARD_GPIO_RD), .gpio(FPGA_GPIO));
  stream_switch #(.data_width(fx3_bus_width), .wfm_fifo_wrusedw_size(12), .wfm_limit(4096)) inst (
    .clk(FX3_PCLK), .reset_n(fpga_reset_n), .data_in(\EP01_data[fx3_bus_width-1..0] ),
    .data_in_valid(EP01_data_valid), .dest_sel(wfm_load), .tx_fifo_rdy(tx_outfifo_rdy), .wfm_rdy(1'b0),
    .wfm_fifo_wrusedw({12{1'b0}}), .data_in_rdy(stream_sw_rdy), .tx_fifo_wr(tx_outfifo_wrreq),
    .tx_fifo_data(tx_outfifo_data), .wfm_fifo_wr(wfm_wr), .wfm_data(wfm_data));
  FPGA_LED1_cntrl inst3 (
    .pll1_locked(mclk1tx_locked), .pll2_locked(rxpll_locked), .alive(fpga_alive), .led_ctrl(FPGA_LED1_CTRL),
    .led_g(FPGA_LED1_G), .led_r(FPGA_LED1_R));
  FPGA_LED2_ctrl inst15 (
    .clk(FPGA_SPI1_SCLK), .reset_n(fpga_reset_n), .adf_muxout(ADF_MUXOUT), .dac_ss(spi_1_enables[0]),
    .adf_ss(FPGA_SPI1_ADF_SS), .led_ctrl(FPGA_LED2_CTRL), .led_g(FPGA_LED2_G), .led_r(FPGA_LED2_R));
  FX3_LED_ctrl inst22 (
    .ctrl_led_g(inst21_out), .ctrl_led_r(FX3_busy), .HW_VER(HW_VER), .led_ctrl(FX3_LED_CTRL),
    .led_g(FX3_LED_G), .led_r(FX3_LED_R));
  busy_delay #(.clock_period(10), .delay_time(200)) inst11 (
    .clk(FX3_PCLK), .reset_n(fpga_reset_n), .busy_in(inst47_out), .busy_out(FX3_busy));
  alive inst4 (.rst(fpga_reset_n), .clk(clk_fpga2), .beat(fpga_alive));
  miso_mux inst18 (
    .fpga_miso(mux_spi_miso), .ext_miso(1'b0), .fpga_cs(BRDG_SPI_FPGA_SS), .ext_cs(ctr_LMS_SPI_CS),
    .out_miso(BRDG_SPI_MISO));
  and inst13 (LMS_RESET, lms1_reset, lms_ctr_gpio[0]);
  tstcfg inst39 (
    .maddress(10'b0000000011), .mimo_en(1'b1), .sdin(FPGA_SPI0_MOSI), .sclk(FPGA_SPI0_SCLK),
    .sen(spi_enables[1]), .lreset(fpga_reset_n), .mreset(fpga_reset_n), .TEST_CMPLT({2'b00, clk_test_cmplt}),
    .TEST_REZ({2'b00, clk_test_rez}), .FX3_CLK_CNT(inst30_fx3_clk_cnt),
    .Si5351C_CLK0_CNT(inst30_si5351c_clk_0_cnt), .Si5351C_CLK1_CNT(inst30_si5351c_clk_1_cnt),
    .Si5351C_CLK2_CNT(inst30_si5351c_clk_2_cnt), .Si5351C_CLK3_CNT(inst30_si5351c_clk_3_cnt),
    .Si5351C_CLK5_CNT(inst30_si5351c_clk_5_cnt), .Si5351C_CLK6_CNT(inst30_si5351c_clk_6_cnt),
    .Si5351C_CLK7_CNT(inst30_si5351c_clk_7_cnt), .LMK_CLK_CNT(inst30_lmk_clk_cnt),
    .ADF_CNT(inst30_adf_muxout_cnt), .DDR2_1_STATUS(3'b000), .DDR2_1_pnf_per_bit({32{1'b0}}),
    .DDR2_2_STATUS(3'b000), .DDR2_2_pnf_per_bit({32{1'b0}}), .sdout(tstcfg_sdout), .TEST_EN(test_en),
    .TEST_FRC_ERR(test_inject_error), .TX_TST_I(TX_TST_I), .TX_TST_Q(TX_TST_Q));  // open: oen, stateo
  or inst40 (mux_spi_miso, 1'b0, pllcfg_sdoutA, tstcfg_sdout);
  OPNDRN inst16 (.IN(spi_1_enables[0]), .OUT(FPGA_SPI1_DAC_SS));
  not inst25 (TX2_2_LB_L, TX2_2_LB_H);
  rx_synchronizers inst20 (
    .clk1(LMS_MCLK2), .clk1_reset_n(rxpll_locked), .clk1_d0(stream_rxen_fx3clk), .clk1_d1(lte_mimo_en),
    .clk1_s0(stream_rxen_mclk2rxpll), .clk1_s1(lte_mimo_en_mclk2rxpll));
  pll_block_rx inst32 (
    .pll_inclk0(LMS_MCLK2), .pll_areset(pllrst_start[1]), .clk(LMK_CLK), .reset(pllrst_start[1]),
    .phase(cnt_phase[9:0]), .phase_ps_en(phcfg_start[1]), .phase_up_dn(phcfg_updn),
    .phase_cnt_sel(cnt_ind[2:0]), .reconfig_data(pllcfg_data), .reconfig_en(pllcfg_start[1]),
    .drct_clk_en(drc_clk_en[1]), .FCLK_ENA(FCLK_ENA[1]), .c0(LMS_FCLK2), .c1(MCLK2RX_pll_d),
    .pll_locked(rxpll_locked), .reconfig_status(rx_reconfig_status), .cfg_busy(rxpllcfg_busy),
    .pll_inclk0_dly(MCLK2RX_dly));
  pll_block_tx inst33 (
    .pll_inclk0(LMS_MCLK1), .pll_areset(pllrst_start[0]), .clk(LMK_CLK), .reset(pllrst_start[0]),
    .phase(cnt_phase[9:0]), .phase_ps_en(phcfg_start[0]), .phase_up_dn(phcfg_updn),
    .phase_cnt_sel(cnt_ind[2:0]), .reconfig_data(pllcfg_data), .reconfig_en(pllcfg_start[0]),
    .drct_clk_en(drc_clk_en[0]), .FCLK_ENA(FCLK_ENA[0]), .c0(LMS_FCLK1), .c1(lmlclk),
    .pll_locked(mclk1tx_locked), .reconfig_status(tx_reconfig_status), .cfg_busy(txpllcfg_busy));
  not inst45 (fpgapll_locked, EXT_GND);
  LTE_tx_path #(.dev_family("Cyclone IV E")) inst34 (
    .RX_clk(LMS_MCLK2), .rxpll_locked(rxpll_locked), .TX_clk(lmlclk), .txpll_locked(mclk1tx_locked),
    .pct_wrclk(FX3_PCLK), .pct_wr(tx_outfifo_wrreq), .pct_data(tx_outfifo_data), .rxpath_wr(wrrxfifo_wr),
    .lte_ch_en(lte_ch_en), .lte_smpl_width(lte_smpl_width), .stream_rxen(stream_rxen),
    .lte_synch_dis(lte_synch_dis), .lte_mimo_en(lte_mimo_en), .lte_clr_smpl_nr(lte_clr_smpl_nr),
    .fr_start(1'b0), .rx_cap_en(1'b1), .tx_reset_req(1'b0), .pct_fifo_rdy(tx_outfifo_rdy),
    .pct_cleared(pct_buff_aclr), .dd_data_h(tx_path_h), .dd_data_l(tx_path_l));
  rx_path #(.dev_family(dev_family), .diq_width(diq_width), .infifo_wrsize(12), .outfifo_size(12)) inst35 (
    .clk_iopll(MCLK2RX_pll_d), .clk_iodirect(MCLK2RX_dly), .clk(LMS_MCLK2), .reset_n(rxpll_locked),
    .en(stream_rxen_fx3clk), .DIQ2(LMS_DIQ2_D), .DIQ2_IQSEL2(LMS_DIQ2_IQSEL2), .drct_clk_en(drc_clk_en[1]),
    .data_src(rx_ptrn_en), .fr_start(1'b0), .mimo_en(lte_mimo_en), .ch_en(lte_ch_en),
    .smpl_width(lte_smpl_width), .pct_clr_detect(pct_buff_aclr), .clr_pct_loss_flag(lte_txpct_loss_clr),
    .clr_smpl_nr(lte_clr_smpl_nr), .outfifo_full(fx3_outfifo_wfull),
    .outfifo_wrusedw({12{\fx3_outfifo_wrusedw[fx3_outfifo_wrsize-1..0] }}), .outfifo_wr(rxpct_outfifowr),
    .outfifo_data(rx_pct_data), .wrrxfifo_wr(wrrxfifo_wr));
  pllcfg_top #(.n_pll(2)) inst9 (
    .sdinA(FPGA_SPI0_MOSI), .sclkA(FPGA_SPI0_SCLK), .senA(spi_enables[1]), .lreset(fpga_reset_n),
    .mreset(fpga_reset_n), .pllcfg_busy({1'b0, pllcfg_busy}), .pllcfg_done({1'b1, pllcfg_done}),
    .pll_lock({rxpll_locked, mclk1tx_locked}), .sdoutA(pllcfg_sdoutA), .oenA(pllcfg_oenA),
    .phcfg_start(phcfg_start), .pllcfg_start(pllcfg_start), .pllrst_start(pllrst_start),
    .phcfg_updn(phcfg_updn), .cnt_ind(cnt_ind), .cnt_phase(cnt_phase), .pllcfg_data(pllcfg_data));  // open: sdinB, sclkB, senB, sdoutB, oenB
  or inst12 (pllcfg_busy, rxpllcfg_busy, txpllcfg_busy);
  not inst14 (pllcfg_done, pllcfg_busy);
  lms7002_ddout #(.dev_family(dev_family), .iq_width(12)) inst7 (
    .clk(lmlclk), .reset_n(mclk1tx_locked), .data_in_h(ddmux_h), .data_in_l(ddmux_l), .txiq(LMS_DIQ1_D),
    .txiqsel(LMS_DIQ1_IQSEL));
  txiqmux #(.diq_width(12)) inst10 (
    .clk(lmlclk), .reset_n(mclk1tx_locked), .test_ptrn_en(tx_ptrn_en), .test_ptrn_fidm(1'b0),
    .test_ptrn_I(TX_TST_I), .test_ptrn_Q(TX_TST_Q), .test_data_en(tx_cnt_en), .test_data_mimo_en(1'b1),
    .mux_sel(wfm_play), .tx_diq_h(tx_path_h), .tx_diq_l(tx_path_l), .wfm_diq_h({13{1'b0}}),
    .wfm_diq_l({13{1'b0}}), .diq_h(ddmux_h), .diq_l(ddmux_l));

  // Other names for the same wires on the sheet: fadr[1:0] = {FX3_CTL11, FX3_CTL12}; fpga_reset = EXT_GND;
  //   fx3_clk = FX3_PCLK; FX3_MCU_BUSY = FX3_CTL8;
  //   GPIO (some bits) = {TX2_2_LB_SH, TX2_2_LB_AT, TX2_2_LB_H, TX1_2_LB_SH, TX1_2_LB_AT, TX1_2_LB_H};
  //   MCLK1TX = LMS_MCLK1; MCLK2RX = LMS_MCLK2; MCLK2RX_pll = LMS_FCLK2; spi_1_enables[1] = FPGA_SPI1_ADF_SS;
  //   spi_enables[0] = FPGA_SPI0_LMS_SS; spi_lms_external_MOSI = FPGA_SPI0_MOSI;
  //   spi_lms_external_SCLK = FPGA_SPI0_SCLK; txiq[11:0] = LMS_DIQ1_D; txiqsel = LMS_DIQ1_IQSEL

  // Notes on the sheet:
  //   PLL`s and pll control
  //   General I/O, clock pins, ect
  //   fx3_clk
  //   Stream out buffer
  //   Board SPI
  //   For v1.1 board compatibility. 
  //   v1.1 board has GND connected to J3, to avoid shorting output directly to ground 
  //   Open-drain output with weak pull up implemented
  //   NIOS CPU
  //   FX3 slaveFIFo interface
  //   LML TX interface synchronization
  //   fx3_outfifo_wrsize=ceil(log2(desired fifo word count in wr side))+1
  //   fx3_outfifo_rdsize=ceil(log2(desired fifo word count in wr side*fx3_outfifo_wrwidth/fx3_bus_width))+1
  //   LMS GPIO
  //   WFM player
  //   FPGA registers
  //   DDR2_2 memory test logic
  //   DESCRIPTION
  //   BOARD
  //   LimeSDR-USB
  //   DATE
  //   2016-09-27
  //   AUTHOR
  //   Lime Microsystems
endmodule
